# EAGLE schematic aleph (EAGLE 6.4), part 1 of 2

## Sheet 1 of 9
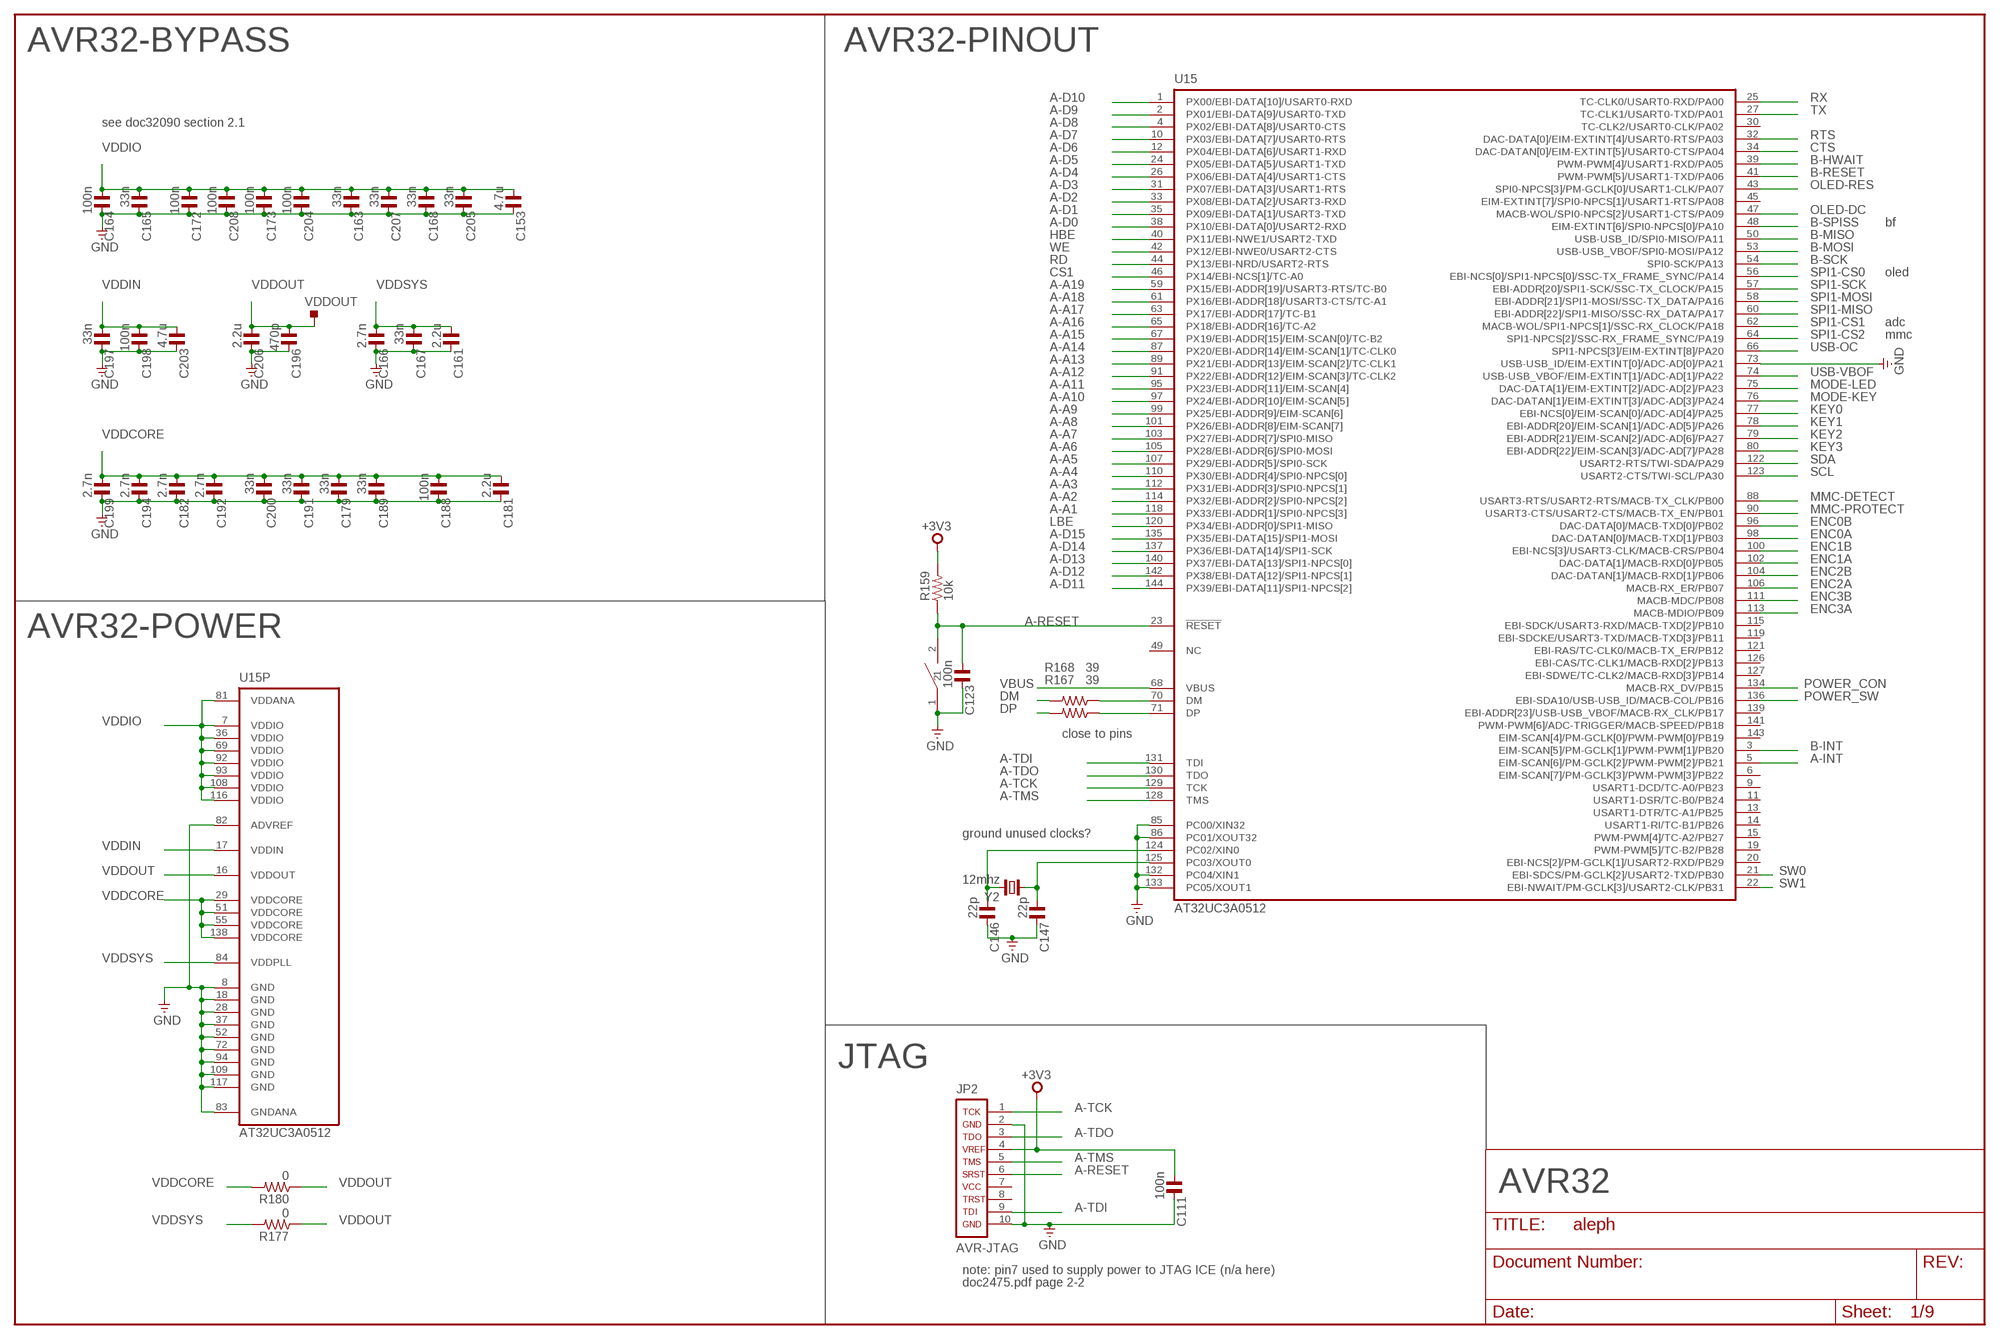
[diagram p0: schematic, sheet 1]

### Parts
C111  100n  C_0603  [C0603]
C123  100n  C_0603  [C0603]
C146  22p  C_0603  [C0603]
C147  22p  C_0603  [C0603]
C153  4.7u  C_1206  [C1206]
C161  2.2u  C_1206  [C1206]
C163  33n  C_0603  [C0603]
C164  100n  C_0603  [C0603]
C165  33n  C_0603  [C0603]
C166  2.7n  C_0603  [C0603]
C167  33n  C_0603  [C0603]
C168  33n  C_0603  [C0603]
C172  100n  C_0603  [C0603]
C173  100n  C_0603  [C0603]
C179  33n  C_0603  [C0603]
C181  2.2u  C_1206  [C1206]
C182  2.7n  C_0603  [C0603]
C188  100n  C_0603  [C0603]
C189  33n  C_0603  [C0603]
C191  33n  C_0603  [C0603]
C192  2.7n  C_0603  [C0603]
C194  2.7n  C_0603  [C0603]
C196  470p  C_0603  [C0603]
C197  33n  C_0603  [C0603]
C198  100n  C_0603  [C0603]
C199  2.7n  C_0603  [C0603]
C200  33n  C_0603  [C0603]
C203  4.7u  C_1206  [C1206]
C204  100n  C_0603  [C0603]
C205  33n  C_0603  [C0603]
C206  2.2u  C_1206  [C1206]
C207  33n  C_0603  [C0603]
C208  100n  C_0603  [C0603]
JP2  AVR-JTAG  AVR-JTAG-10  [AVR-JTAG-10]
R159  10k  R_0603  [R0603]
R167  39  R_0603  [R0603]
R168  39  R_0603  [R0603]
R177  0  R_0603  [R0603]
R180  0  R_0603  [R0603]
SW1  PANASONIC-EVQ  [PANASONIC-EVQ]
U15  AT32UC3A0512  AT32UC3A0128/0256/0512  [LQFP144]
VDDOUT  TPS-SMD-10R  [SMD-10R]
Y2  12mhz  CRYTALHC49UP  [HC49UP]

### Nets
+3V3: C111.1 JP2.4 R159.2 ; also sheet 2,3
A-A1: U15.118(PX33/EBI-ADDR[1]/SPI0-NPCS[3]) ; also sheet 2
A-A2: U15.114(PX32/EBI-ADDR[2]/SPI0-NPCS[2]) ; also sheet 2
A-A3: U15.112(PX31/EBI-ADDR[3]/SPI0-NPCS[1]) ; also sheet 2
A-A4: U15.110(PX30/EBI-ADDR[4]/SPI0-NPCS[0]) ; also sheet 2
A-A5: U15.107(PX29/EBI-ADDR[5]/SPI0-SCK) ; also sheet 2
A-A6: U15.105(PX28/EBI-ADDR[6]/SPI0-MOSI) ; also sheet 2
A-A7: U15.103(PX27/EBI-ADDR[7]/SPI0-MISO) ; also sheet 2
A-A8: U15.101(PX26/EBI-ADDR[8]/EIM-SCAN[7]) ; also sheet 2
A-A9: U15.99(PX25/EBI-ADDR[9]/EIM-SCAN[6]) ; also sheet 2
A-A10: U15.97(PX24/EBI-ADDR[10]/EIM-SCAN[5]) ; also sheet 2
A-A11: U15.95(PX23/EBI-ADDR[11]/EIM-SCAN[4]) ; also sheet 2
A-A12: U15.91(PX22/EBI-ADDR[12]/EIM-SCAN[3]/TC-CLK2) ; also sheet 2
A-A13: U15.89(PX21/EBI-ADDR[13]/EIM-SCAN[2]/TC-CLK1) ; also sheet 2
A-A14: U15.87(PX20/EBI-ADDR[14]/EIM-SCAN[1]/TC-CLK0) ; also sheet 2
A-A15: U15.67(PX19/EBI-ADDR[15]/EIM-SCAN[0]/TC-B2) ; also sheet 2
A-A16: U15.65(PX18/EBI-ADDR[16]/TC-A2) ; also sheet 2
A-A17: U15.63(PX17/EBI-ADDR[17]/TC-B1) ; also sheet 2
A-A18: U15.61(PX16/EBI-ADDR[18]/USART3-CTS/TC-A1) ; also sheet 2
A-A19: U15.59(PX15/EBI-ADDR[19]/USART3-RTS/TC-B0) ; also sheet 2
A-D0: U15.38(PX10/EBI-DATA[0]/USART2-RXD) ; also sheet 2
A-D1: U15.35(PX09/EBI-DATA[1]/USART3-TXD) ; also sheet 2
A-D2: U15.33(PX08/EBI-DATA[2]/USART3-RXD) ; also sheet 2
A-D3: U15.31(PX07/EBI-DATA[3]/USART1-RTS) ; also sheet 2
A-D4: U15.26(PX06/EBI-DATA[4]/USART1-CTS) ; also sheet 2
A-D5: U15.24(PX05/EBI-DATA[5]/USART1-TXD) ; also sheet 2
A-D6: U15.12(PX04/EBI-DATA[6]/USART1-RXD) ; also sheet 2
A-D7: U15.10(PX03/EBI-DATA[7]/USART0-RTS) ; also sheet 2
A-D8: U15.4(PX02/EBI-DATA[8]/USART0-CTS) ; also sheet 2
A-D9: U15.2(PX01/EBI-DATA[9]/USART0-TXD) ; also sheet 2
A-D10: U15.1(PX00/EBI-DATA[10]/USART0-RXD) ; also sheet 2
A-D11: U15.144(PX39/EBI-DATA[11]/SPI1-NPCS[2]) ; also sheet 2
A-D12: U15.142(PX38/EBI-DATA[12]/SPI1-NPCS[1]) ; also sheet 2
A-D13: U15.140(PX37/EBI-DATA[13]/SPI1-NPCS[0]) ; also sheet 2
A-D14: U15.137(PX36/EBI-DATA[14]/SPI1-SCK) ; also sheet 2
A-D15: U15.135(PX35/EBI-DATA[15]/SPI1-MOSI) ; also sheet 2
A-INT: U15.5(EIM-SCAN[6]/PM-GCLK[2]/PWM-PWM[2]/PB21) ; also sheet 4
A-RESET: C123.1 JP2.6 R159.1 SW1.2 U15.23(!RESET)
A-TCK: JP2.1 U15.129(TCK)
A-TDI: JP2.9 U15.131(TDI)
A-TDO: JP2.3 U15.130(TDO)
A-TMS: JP2.5 U15.128(TMS)
B-HWAIT: U15.39(PWM-PWM[4]/USART1-RXD/PA05) ; also sheet 4
B-INT: U15.3(EIM-SCAN[5]/PM-GCLK[1]/PWM-PWM[1]/PB20) ; also sheet 4
B-MISO: U15.50(USB-USB_ID/SPI0-MISO/PA11) ; also sheet 4
B-MOSI: U15.53(USB-USB_VBOF/SPI0-MOSI/PA12) ; also sheet 4
B-RESET: U15.41(PWM-PWM[5]/USART1-TXD/PA06) ; also sheet 4
B-SCK: U15.54(SPI0-SCK/PA13) ; also sheet 4
B-SPISS: U15.48(EIM-EXTINT[6]/SPI0-NPCS[0]/PA10) ; also sheet 4
CS1: U15.46(PX14/EBI-NCS[1]/TC-A0) ; also sheet 2
CTS: U15.34(DAC-DATAN[0]/EIM-EXTINT[5]/USART0-CTS/PA04) ; also sheet 2
DM: R168.2 ; also sheet 2
DP: R167.2 ; also sheet 2
ENC0A: U15.98(DAC-DATAN[0]/MACB-TXD[1]/PB03) ; also sheet 3
ENC0B: U15.96(DAC-DATA[0]/MACB-TXD[0]/PB02) ; also sheet 3
ENC1A: U15.102(DAC-DATA[1]/MACB-RXD[0]/PB05) ; also sheet 3
ENC1B: U15.100(EBI-NCS[3]/USART3-CLK/MACB-CRS/PB04) ; also sheet 3
ENC2A: U15.106(MACB-RX_ER/PB07) ; also sheet 3
ENC2B: U15.104(DAC-DATAN[1]/MACB-RXD[1]/PB06) ; also sheet 3
ENC3A: U15.113(MACB-MDIO/PB09) ; also sheet 3
ENC3B: U15.111(MACB-MDC/PB08) ; also sheet 3
GND: C111.2 C123.2 C146.2 C147.2 C153.2 C161.2 C163.2 C164.2 C165.2 C166.2 C167.2 C168.2 C172.2 C173.2 C179.2 C181.2 C182.2 C188.2 C189.2 C191.2 C192.2 C194.2 C196.2 C197.2 C198.2 C199.2 C200.2 C203.2 C204.2 C205.2 C206.2 C207.2 C208.2 JP2.2 JP2.10 SW1.1 U15.8(GND) U15.18(GND) U15.28(GND) U15.37(GND) U15.52(GND) U15.72(GND) U15.73(USB-USB_ID/EIM-EXTINT[0]/ADC-AD[0]/PA21) U15.82(ADVREF) U15.83(GNDANA) U15.85(PC00/XIN32) U15.86(PC01/XOUT32) U15.94(GND) U15.109(GND) U15.117(GND) U15.132(PC04/XIN1) U15.133(PC05/XOUT1) ; also sheet 2,3,4,5
HBE: U15.40(PX11/EBI-NWE1/USART2-TXD) ; also sheet 2
KEY0: U15.77(EBI-NCS[0]/EIM-SCAN[0]/ADC-AD[4]/PA25) ; also sheet 3
KEY1: U15.78(EBI-ADDR[20]/EIM-SCAN[1]/ADC-AD[5]/PA26) ; also sheet 3
KEY2: U15.79(EBI-ADDR[21]/EIM-SCAN[2]/ADC-AD[6]/PA27) ; also sheet 3
KEY3: U15.80(EBI-ADDR[22]/EIM-SCAN[3]/ADC-AD[7]/PA28) ; also sheet 3
LBE: U15.120(PX34/EBI-ADDR[0]/SPI1-MISO) ; also sheet 2
MMC-DETECT: U15.88(USART3-RTS/USART2-RTS/MACB-TX_CLK/PB00) ; also sheet 2
MMC-PROTECT: U15.90(USART3-CTS/USART2-CTS/MACB-TX_EN/PB01) ; also sheet 2
MODE-KEY: U15.76(DAC-DATAN[1]/EIM-EXTINT[3]/ADC-AD[3]/PA24) ; also sheet 3
MODE-LED: U15.75(DAC-DATA[1]/EIM-EXTINT[2]/ADC-AD[2]/PA23) ; also sheet 3
N$4: C146.1 U15.124(PC02/XIN0) Y2.2
N$5: C147.1 U15.125(PC03/XOUT0) Y2.1
N$44: R168.1 U15.70(DM)
N$45: R167.1 U15.71(DP)
OLED-DC: U15.47(MACB-WOL/SPI0-NPCS[2]/USART1-CTS/PA09) ; also sheet 3
OLED-RES: U15.43(SPI0-NPCS[3]/PM-GCLK[0]/USART1-CLK/PA07) ; also sheet 3
POWER_CON: U15.134(MACB-RX_DV/PB15) ; also sheet 2
POWER_SW: U15.136(EBI-SDA10/USB-USB_ID/MACB-COL/PB16) ; also sheet 2
RD: U15.44(PX13/EBI-NRD/USART2-RTS) ; also sheet 2
RTS: U15.32(DAC-DATA[0]/EIM-EXTINT[4]/USART0-RTS/PA03) ; also sheet 2
RX: U15.25(TC-CLK0/USART0-RXD/PA00) ; also sheet 2
SCL: U15.123(USART2-CTS/TWI-SCL/PA30) ; also sheet 3
SDA: U15.122(USART2-RTS/TWI-SDA/PA29) ; also sheet 3
SPI1-CS0: U15.56(EBI-NCS[0]/SPI1-NPCS[0]/SSC-TX_FRAME_SYNC/PA14) ; also sheet 3
SPI1-CS1: U15.62(MACB-WOL/SPI1-NPCS[1]/SSC-RX_CLOCK/PA18) ; also sheet 3
SPI1-CS2: U15.64(SPI1-NPCS[2]/SSC-RX_FRAME_SYNC/PA19) ; also sheet 2
SPI1-MISO: U15.60(EBI-ADDR[22]/SPI1-MISO/SSC-RX_DATA/PA17) ; also sheet 2,3
SPI1-MOSI: U15.58(EBI-ADDR[21]/SPI1-MOSI/SSC-TX_DATA/PA16) ; also sheet 2,3
SPI1-SCK: U15.57(EBI-ADDR[20]/SPI1-SCK/SSC-TX_CLOCK/PA15) ; also sheet 2,3
SW0: U15.21(EBI-SDCS/PM-GCLK[2]/USART2-TXD/PB30) ; also sheet 3
SW1: U15.22(EBI-NWAIT/PM-GCLK[3]/USART2-CLK/PB31) ; also sheet 3
TX: U15.27(TC-CLK1/USART0-TXD/PA01) ; also sheet 2
USB-OC: U15.66(SPI1-NPCS[3]/EIM-EXTINT[8]/PA20) ; also sheet 2
USB-VBOF: U15.74(USB-USB_VBOF/EIM-EXTINT[1]/ADC-AD[1]/PA22) ; also sheet 2
VBUS: U15.68(VBUS) ; also sheet 2
VDDCORE: C179.1 C181.1 C182.1 C188.1 C189.1 C191.1 C192.1 C194.1 C199.1 C200.1 R180.2 U15.29(VDDCORE) U15.51(VDDCORE) U15.55(VDDCORE) U15.138(VDDCORE)
VDDIN: C197.1 C198.1 C203.1 U15.17(VDDIN) ; also sheet 2
VDDIO: C153.1 C163.1 C164.1 C165.1 C168.1 C172.1 C173.1 C204.1 C205.1 C207.1 C208.1 U15.7(VDDIO) U15.36(VDDIO) U15.69(VDDIO) U15.81(VDDANA) U15.92(VDDIO) U15.93(VDDIO) U15.108(VDDIO) U15.116(VDDIO) ; also sheet 2
VDDOUT: C196.1 C206.1 R177.1 R180.1 U15.16(VDDOUT) VDDOUT.TP
VDDSYS: C161.1 C166.1 C167.1 R177.2 U15.84(VDDPLL)
WE: U15.42(PX12/EBI-NWE0/USART2-CTS) ; also sheet 2
Unconnected: JP2.7 JP2.8 U15.6(EIM-SCAN[7]/PM-GCLK[3]/PWM-PWM[3]/PB22) U15.9(USART1-DCD/TC-A0/PB23) U15.11(USART1-DSR/TC-B0/PB24) U15.13(USART1-DTR/TC-A1/PB25) U15.14(USART1-RI/TC-B1/PB26) U15.15(PWM-PWM[4]/TC-A2/PB27) U15.19(PWM-PWM[5]/TC-B2/PB28) U15.20(EBI-NCS[2]/PM-GCLK[1]/USART2-RXD/PB29) U15.30(TC-CLK2/USART0-CLK/PA02) U15.45(EIM-EXTINT[7]/SPI0-NPCS[1]/USART1-RTS/PA08) U15.49(NC) U15.115(EBI-SDCK/USART3-RXD/MACB-TXD[2]/PB10) U15.119(EBI-SDCKE/USART3-TXD/MACB-TXD[3]/PB11) U15.121(EBI-RAS/TC-CLK0/MACB-TX_ER/PB12) U15.126(EBI-CAS/TC-CLK1/MACB-RXD[2]/PB13) U15.127(EBI-SDWE/TC-CLK2/MACB-RXD[3]/PB14) U15.139(EBI-ADDR[23]/USB-USB_VBOF/MACB-RX_CLK/PB17) U15.141(PWM-PWM[6]/ADC-TRIGGER/MACB-SPEED/PB18) U15.143(EIM-SCAN[4]/PM-GCLK[0]/PWM-PWM[0]/PB19)

### Notes on the sheet
- AVR32-BYPASS | AVR32-PINOUT
- see doc32090 section 2.1
- bf
- oled
- adc
- mmc
- AVR32-POWER
- close to pins
- ground unused clocks?
- JTAG
- AVR32
- note: pin7 used to supply power to JTAG ICE (n/a here)
- doc2475.pdf page 2-2

## Sheet 2 of 9
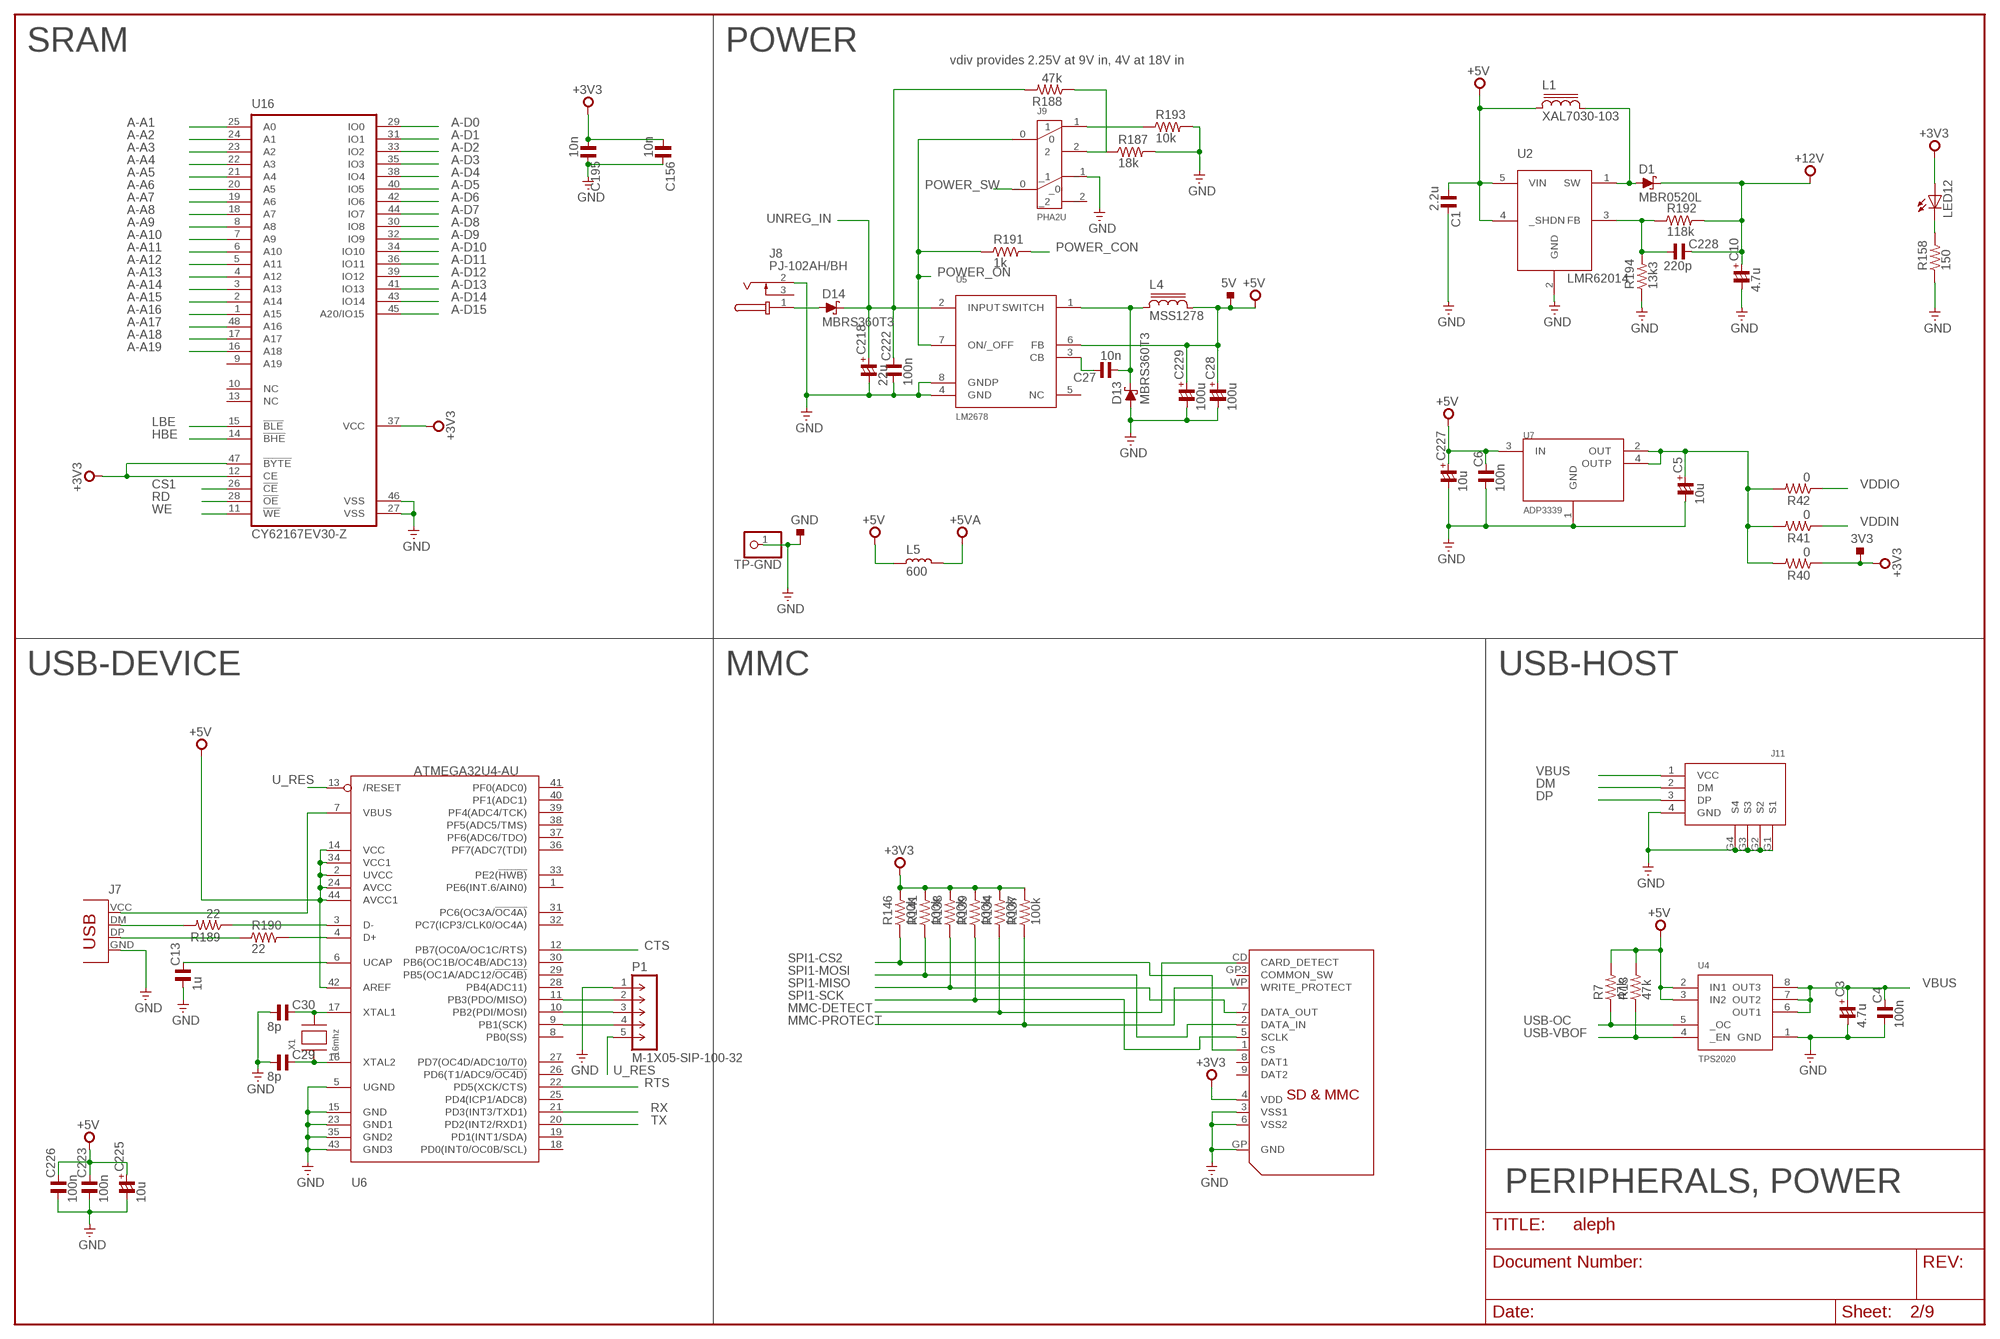
[diagram p1: schematic, sheet 2]

### Parts
3V3  TPS-SMD-15R  [SMD-15R]
5V  TPS-SMD-15R  [SMD-15R]
C1  2.2u  C_1206  [C1206]
C3  4.7u  CP_1206/T  [C1206/T]
C4  100n  C_0603  [C0603]
C5  10u  CP_1206/T  [C1206/T]
C6  100n  C_1206  [C1206]
C10  4.7u  CP_1206/T  [C1206/T]
C13  1u  C_0603  [C0603]
C27  10n  C_0603  [C0603]
C28  100u  CP_7343-43  [C7343-43]
C29  8p  C_0603  [C0603]
C30  8p  C_0603  [C0603]
C156  10n  C_0603  [C0603]
C195  10n  C_0603  [C0603]
C218  22u  CP_6032-28  [C6032-28/T]
C222  100n  C_1206  [C1206]
C223  100n  C_0603  [C0603]
C225  10u  CP_1206/T  [C1206/T]
C226  100n  C_0603  [C0603]
C227  10u  CP_1206/T  [C1206/T]
C228  220p  C_0603  [C0603]
C229  100u  CP_7343-43  [C7343-43]
D1  MBR0520L  MBR0540  [SOD123]
D13  MBRS360T3  [SMC]
D14  MBRS360T3  [SMC]
GND  TPS-SMD-20R  [SMD-20R]
J7  USB_TYPE_B  [USB_B]
J8  PJ-102AH/BH  [PJ-102XH]
J9  PHA2U  [PHA2U]
J11  USBA-VERT  [USBA-VERT]
L1  XAL7030-103  [XAL7030-103]
L4  MSS1278  [MSS1278]
L5  600  L_0603  [L0603]
LED12  LEDCHIPLED_0805  [CHIPLED_0805]
P1  M-1X05-SIP-100-32  [SIP-100-05-32]
R7  47k  R_0603  [R0603]
R13  47k  R_0603  [R0603]
R40  0  R_0603  [R0603]
R41  0  R_0603  [R0603]
R42  0  R_0603  [R0603]
R134  100k  R_0603  [R0603]
R137  100k  R_0603  [R0603]
R138  100k  R_0603  [R0603]
R139  100k  R_0603  [R0603]
R141  100k  R_0603  [R0603]
R146  100k  R_0603  [R0603]
R158  150  R_0603  [R0603]
R187  18k  R_0603  [R0603]
R188  47k  R_0603  [R0603]
R189  22  R_0603  [R0603]
R190  22  R_0603  [R0603]
R191  1k  R_0603  [R0603]
R192  118k  R_0603  [R0603]
R193  10k  R_0603  [R0603]
R194  13k3  R_0603  [R0603]
S1  SDMMC06132  [06132]
TP-GND  PINHD-1X1  [1X01]
U2  LMR62014  [SOT23-5]
U4  TPS2020  [SO08]
U5  LM2678  [TO263-7]
U6  ATMEGA32U4-AU  [TQFP44]
U7  ADP3339  [SOT223]
U16  CY62167EV30-Z  [TSOP48]
X1  16mhz  XTALNX5032  [NX5032]

### Nets
+3V3: 3V3.TP C156.1 C195.1 LED12.A R40.1 R134.2 R137.2 R138.2 R139.2 R141.2 R146.2 S1.4(VDD) U16.12(CE) U16.37(VCC) U16.47(!BYTE!) ; also sheet 1,3
+5V: 5V.TP C1.1 C6.2 C28.+ C223.2 C225.+ C226.2 C227.+ C229.+ L1.P$1 L4.2 L5.2 R7.2 R13.2 U2.4(_SHDN) U2.5(VIN) U4.2(IN1) U4.3(IN2) U5.6(FB) U6.2(UVCC) U6.14(VCC) U6.24(AVCC) U6.34(VCC1) U6.42(AREF) U6.44(AVCC1) U7.3(IN) ; also sheet 3,4,6
+5VA: L5.1 ; also sheet 3,6,7,9
+12V: C10.+ C228.2 D1.C R192.2 ; also sheet 3,6
A-A1: U16.25(A0) ; also sheet 1
A-A2: U16.24(A1) ; also sheet 1
A-A3: U16.23(A2) ; also sheet 1
A-A4: U16.22(A3) ; also sheet 1
A-A5: U16.21(A4) ; also sheet 1
A-A6: U16.20(A5) ; also sheet 1
A-A7: U16.19(A6) ; also sheet 1
A-A8: U16.18(A7) ; also sheet 1
A-A9: U16.8(A8) ; also sheet 1
A-A10: U16.7(A9) ; also sheet 1
A-A11: U16.6(A10) ; also sheet 1
A-A12: U16.5(A11) ; also sheet 1
A-A13: U16.4(A12) ; also sheet 1
A-A14: U16.3(A13) ; also sheet 1
A-A15: U16.2(A14) ; also sheet 1
A-A16: U16.1(A15) ; also sheet 1
A-A17: U16.48(A16) ; also sheet 1
A-A18: U16.17(A17) ; also sheet 1
A-A19: U16.16(A18) ; also sheet 1
A-D0: U16.29(IO0) ; also sheet 1
A-D1: U16.31(IO1) ; also sheet 1
A-D2: U16.33(IO2) ; also sheet 1
A-D3: U16.35(IO3) ; also sheet 1
A-D4: U16.38(IO4) ; also sheet 1
A-D5: U16.40(IO5) ; also sheet 1
A-D6: U16.42(IO6) ; also sheet 1
A-D7: U16.44(IO7) ; also sheet 1
A-D8: U16.30(IO8) ; also sheet 1
A-D9: U16.32(IO9) ; also sheet 1
A-D10: U16.34(IO10) ; also sheet 1
A-D11: U16.36(IO11) ; also sheet 1
A-D12: U16.39(IO12) ; also sheet 1
A-D13: U16.41(IO13) ; also sheet 1
A-D14: U16.43(IO14) ; also sheet 1
A-D15: U16.45(A20/IO15) ; also sheet 1
CS1: U16.26(!CE!) ; also sheet 1
CTS: U6.12(PB7(OC0A/OC1C/RTS)) ; also sheet 1
DM: J11.2(DM) ; also sheet 1
DP: J11.3(DP) ; also sheet 1
GND: C1.2 C3.- C4.1 C5.- C6.1 C10.- C13.1 C28.- C29.1 C30.1 C156.2 C195.2 C218.- C222.1 C223.1 C225.- C226.1 C227.- C229.- D13.A GND.TP J7.GND J8.2(S) J9._1 J11.4(GND) J11.G1(S1) J11.G2(S2) J11.G3(S3) J11.G4(S4) P1.1 R158.1 R187.2 R193.2 R194.1 S1.3(VSS1) S1.6(VSS2) S1.GP(GND) TP-GND.1 U2.2(GND) U4.1(GND) U5.4(GND) U5.8(GNDP) U6.5(UGND) U6.15(GND) U6.23(GND1) U6.35(GND2) U6.43(GND3) U7.1(GND) U16.27(VSS) U16.46(VSS) ; also sheet 1,3,4,5
HBE: U16.14(!BHE!) ; also sheet 1
LBE: U16.15(!BLE!) ; also sheet 1
MMC-DETECT: R134.1 S1.CD(CARD_DETECT) ; also sheet 1
MMC-PROTECT: R137.1 S1.WP(WRITE_PROTECT) ; also sheet 1
N$3: D14.A J8.1(T)
N$6: J7.DM(USBDM) R189.2
N$7: C27.1 D13.C L4.1 U5.1(SWITCH)
N$9: C27.2 U5.3(CB)
N$12: J7.DP(USBDP) R190.1
N$13: R190.2 U6.4(D+)
N$15: LED12.C R158.2
N$17: R189.1 U6.3(D-)
N$32: C5.+ R40.2 R41.2 R42.2 U7.2(OUT) U7.4(OUTP)
N$50: J9.1 R193.1
N$55: J9.2 R187.1 R188.1
N$109: C29.2 U6.16(XTAL2) X1.P$1
N$112: C30.2 U6.17(XTAL1) X1.P$2
N$133: D1.A L1.P$2 U2.1(SW)
N$134: C228.1 R192.1 R194.2 U2.3(FB)
N$160: C13.2 U6.6(UCAP)
N$161: J7.VCC U6.7(VBUS)
POWER_CON: R191.2 ; also sheet 1
POWER_ON: J9.0 R191.1 U5.7(ON/_OFF)
POWER_SW: J9._0 ; also sheet 1
RD: U16.28(!OE!) ; also sheet 1
RTS: U6.22(PD5(XCK/CTS)) ; also sheet 1
RX: U6.21(PD3(INT3/TXD1)) ; also sheet 1
SPI1-CS2: R146.1 S1.1(CS) ; also sheet 1
SPI1-MISO: R138.1 S1.7(DATA_OUT) ; also sheet 1,3
SPI1-MOSI: R141.1 S1.2(DATA_IN) ; also sheet 1,3
SPI1-SCK: R139.1 S1.5(SCLK) ; also sheet 1,3
TX: U6.20(PD2(INT2/RXD1)) ; also sheet 1
U-MISO: P1.2 U6.11(PB3(PDO/MISO))
U-MOSI: P1.3 U6.10(PB2(PDI/MOSI))
U-SCK: P1.4 U6.9(PB1(SCK))
U_RES: P1.5 U6.13(/RESET)
UNREG_IN: C218.+ C222.2 D14.C R188.2 U5.2(INPUT)
USB-OC: R7.1 U4.5(_OC) ; also sheet 1
USB-VBOF: R13.1 U4.4(_EN) ; also sheet 1
VBUS: C3.+ C4.2 J11.1(VCC) U4.6(OUT1) U4.7(OUT2) U4.8(OUT3) ; also sheet 1
VDDIN: R41.1 ; also sheet 1
VDDIO: R42.1 ; also sheet 1
WE: U16.11(!WE!) ; also sheet 1
Unconnected: J8.3(SS) J9._2 S1.8(DAT1) S1.9(DAT2) S1.GP3(COMMON_SW) U5.5(NC) U6.1(PE6(INT.6/AIN0)) U6.8(PB0(SS)) U6.18(PD0(INT0/OC0B/SCL)) U6.19(PD1(INT1/SDA)) U6.25(PD4(ICP1/ADC8)) U6.26(PD6(T1/ADC9/!OC4D)) U6.27(PD7(OC4D/ADC10/T0)) U6.28(PB4(ADC11)) U6.29(PB5(OC1A/ADC12/!OC4B)) U6.30(PB6(OC1B/OC4B/ADC13)) U6.31(PC6(OC3A/!OC4A)) U6.32(PC7(ICP3/CLK0/OC4A)) U6.33(PE2(!HWB)) U6.36(PF7(ADC7(TDI)) U6.37(PF6(ADC6/TDO)) U6.38(PF5(ADC5/TMS)) U6.39(PF4(ADC4/TCK)) U6.40(PF1(ADC1)) U6.41(PF0(ADC0)) U16.9(A19) U16.10(NC) U16.13(NC)

### Notes on the sheet
- SRAM | POWER
- vdiv provides 2.25V at 9V in, 4V at 18V in
- USB-DEVICE | MMC | USB-HOST
- PERIPHERALS, POWER

## Sheet 3 of 9
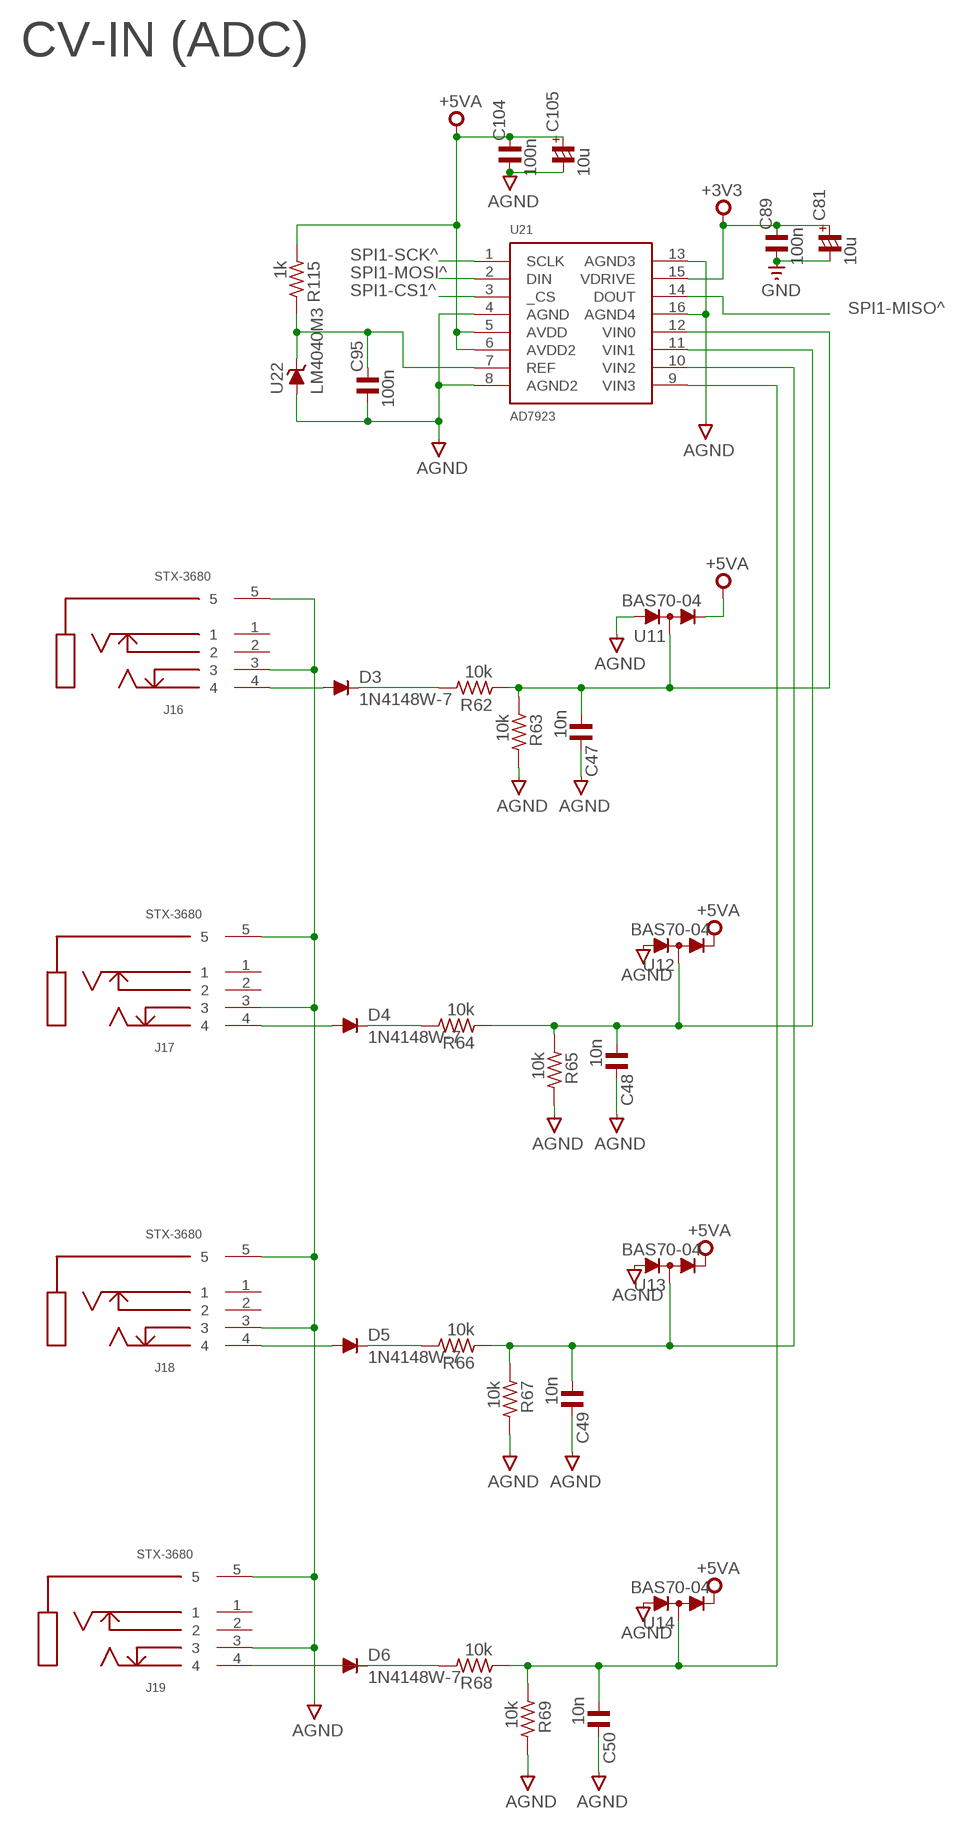
[diagram p2: schematic, sheet 3, part 1 of 2]
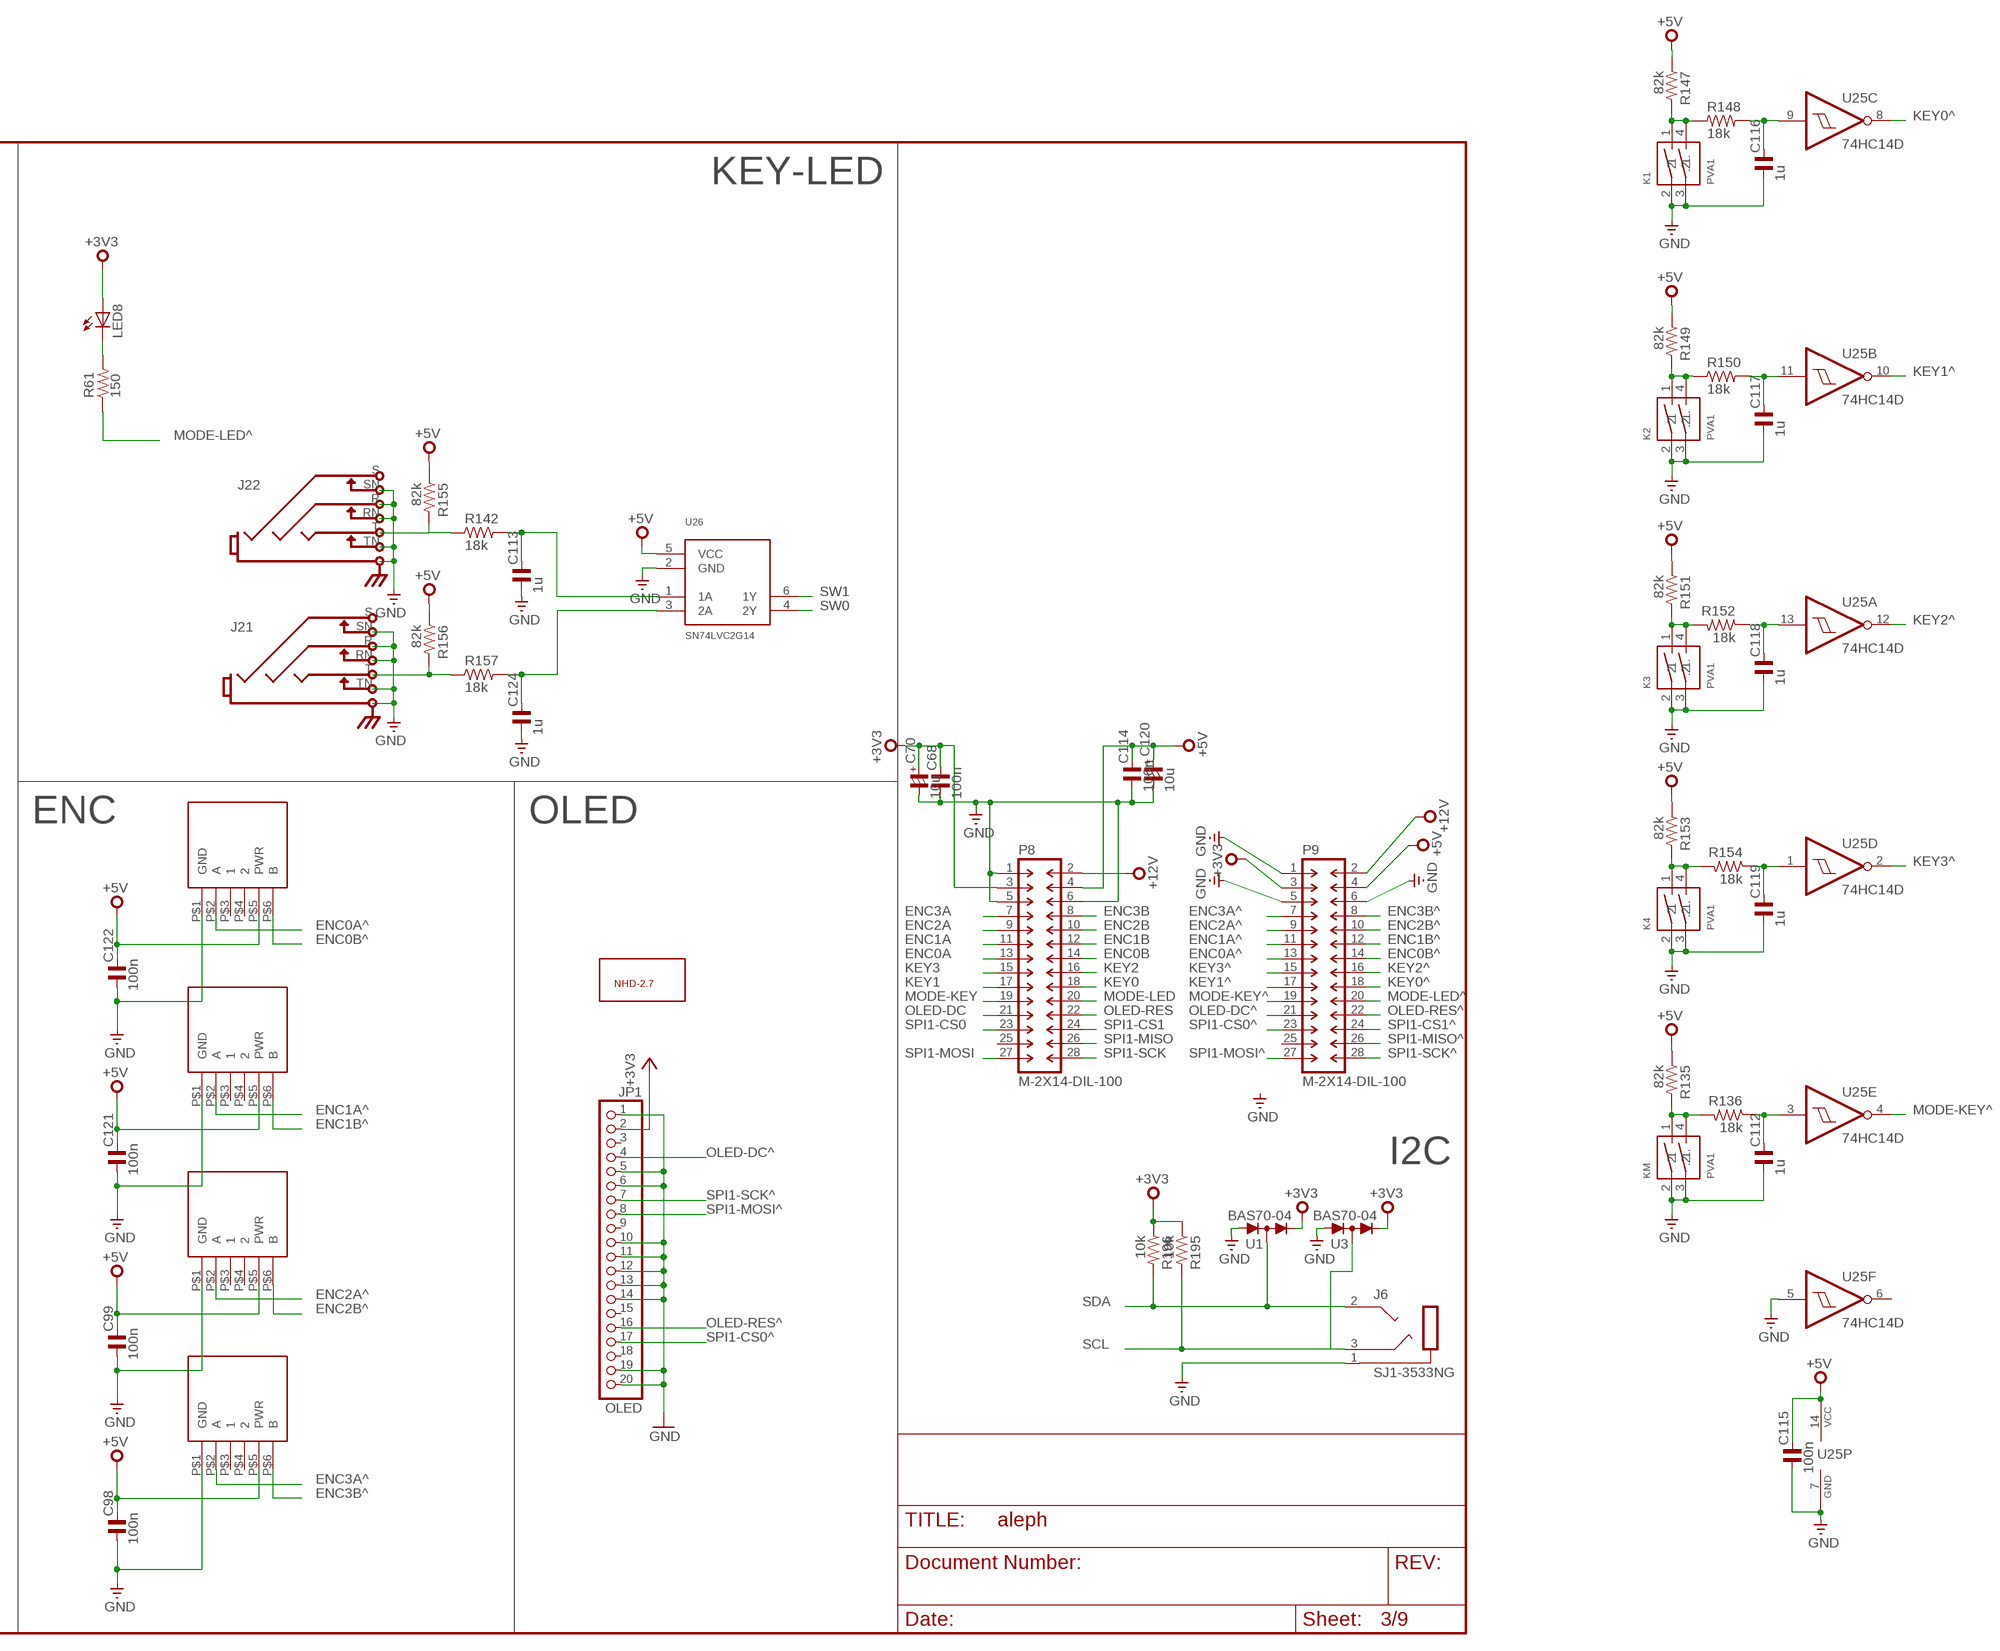
[diagram p3: schematic, sheet 3, part 2 of 2]

### Parts
C47  10n  C_0603  [C0603]
C48  10n  C_0603  [C0603]
C49  10n  C_0603  [C0603]
C50  10n  C_0603  [C0603]
C68  100n  C_0603  [C0603]
C70  10u  CP_1206/T  [C1206/T]
C81  10u  CP_1206/T  [C1206/T]
C89  100n  C_0603  [C0603]
C95  100n  C_0603  [C0603]
C98  100n  C_0603  [C0603]
C99  100n  C_0603  [C0603]
C104  100n  C_0603  [C0603]
C105  10u  CP_1206/T  [C1206/T]
C112  1u  C_0603  [C0603]
C113  1u  C_0603  [C0603]
C114  100n  C_0603  [C0603]
C115  100n  C_0603  [C0603]
C116  1u  C_0603  [C0603]
C117  1u  C_0603  [C0603]
C118  1u  C_0603  [C0603]
C119  1u  C_0603  [C0603]
C120  10u  CP_1206/T  [C1206/T]
C121  100n  C_0603  [C0603]
C122  100n  C_0603  [C0603]
C124  1u  C_0603  [C0603]
D3  1N4148W-7  [SOD123]
D4  1N4148W-7  [SOD123]
D5  1N4148W-7  [SOD123]
D6  1N4148W-7  [SOD123]
E1  BOURNS-EM14  [BOURNS-EM14]
E2  BOURNS-EM14  [BOURNS-EM14]
E3  BOURNS-EM14  [BOURNS-EM14]
E4  BOURNS-EM14  [BOURNS-EM14]
J6  SJ1-3533NG  [SJ1-3533NG]
J16  STX-3680  [STX-3680]
J17  STX-3680  [STX-3680]
J18  STX-3680  [STX-3680]
J19  STX-3680  [STX-3680]
J21  STEREOSW3GND  [NEUTRIK-NRJ6HF-1]
J22  STEREOSW3GND  [NEUTRIK-NRJ6HF-1]
JP1  OLED  PINHD-1X20  [1X20]
K1  PVA1  [PVA1]
K2  PVA1  [PVA1]
K3  PVA1  [PVA1]
K4  PVA1  [PVA1]
KM  PVA1  [PVA1]
LED8  LEDCHIPLED_0805  [CHIPLED_0805]
P8  M-2X14-DIL-100  [DIL-100-2X14]
P9  M-2X14-DIL-100  [DIL-100-2X14]
R61  150  R_0603  [R0603]
R62  10k  R_0603  [R0603]
R63  10k  R_0603  [R0603]
R64  10k  R_0603  [R0603]
R65  10k  R_0603  [R0603]
R66  10k  R_0603  [R0603]
R67  10k  R_0603  [R0603]
R68  10k  R_0603  [R0603]
R69  10k  R_0603  [R0603]
R115  1k  R_0603  [R0603]
R135  82k  R_0603  [R0603]
R136  18k  R_0603  [R0603]
R142  18k  R_0603  [R0603]
R147  82k  R_0603  [R0603]
R148  18k  R_0603  [R0603]
R149  82k  R_0603  [R0603]
R150  18k  R_0603  [R0603]
R151  82k  R_0603  [R0603]
R152  18k  R_0603  [R0603]
R153  82k  R_0603  [R0603]
R154  18k  R_0603  [R0603]
R155  82k  R_0603  [R0603]
R156  82k  R_0603  [R0603]
R157  18k  R_0603  [R0603]
R195  10k  R_0603  [R0603]
R196  10k  R_0603  [R0603]
REF-OLED  NHD-2.7  [NHD-2.7]
U1  BAS70-04  [SOT23]
U3  BAS70-04  [SOT23]
U11  BAS70-04  [SOT23]
U12  BAS70-04  [SOT23]
U13  BAS70-04  [SOT23]
U14  BAS70-04  [SOT23]
U21  AD7923  [TSSOP16]
U22  LM4040M3  [SOT23]
U25  74HC14D  [SO14]
U26  SN74LVC2G14  [SOT23-6]

### Nets
+3V3: C68.2 C70.+ C81.+ C89.2 JP1.2 LED8.A P8.3 P9.3 R195.1 R196.1 U1.2(C) U3.2(C) U21.15(VDRIVE) ; also sheet 1,2
+5V: C98.2 C99.2 C114.2 C115.2 C120.+ C121.2 C122.2 E1.P$5(PWR) E2.P$5(PWR) E3.P$5(PWR) E4.P$5(PWR) P8.4 P9.4 R135.1 R147.1 R149.1 R151.1 R153.1 R155.1 R156.1 U25.14(P:VCC) U26.5(VCC) ; also sheet 2,4,6
+5VA: C104.2 C105.+ R115.1 U11.2(C) U12.2(C) U13.2(C) U14.2(C) U21.5(AVDD) U21.6(AVDD2) ; also sheet 2,6,7,9
+12V: P8.2 P9.2 ; also sheet 2,6
AGND: C47.2 C48.2 C49.2 C50.2 C95.1 C104.1 C105.- J16.3 J16.5 J17.3 J17.5 J18.3 J18.5 J19.3 J19.5 R63.2 R65.2 R67.2 R69.2 U11.1(A) U12.1(A) U13.1(A) U14.1(A) U21.4(AGND) U21.8(AGND2) U21.13(AGND3) U21.16(AGND4) U22.2(A) ; also sheet 5,6,7,8,9
ENC0A: P8.13 ; also sheet 1
ENC0A^: E1.P$2(A) P9.13
ENC0B: P8.14 ; also sheet 1
ENC0B^: E1.P$6(B) P9.14
ENC1A: P8.11 ; also sheet 1
ENC1A^: E2.P$2(A) P9.11
ENC1B: P8.12 ; also sheet 1
ENC1B^: E2.P$6(B) P9.12
ENC2A: P8.9 ; also sheet 1
ENC2A^: E4.P$2(A) P9.9
ENC2B: P8.10 ; also sheet 1
ENC2B^: E4.P$6(B) P9.10
ENC3A: P8.7 ; also sheet 1
ENC3A^: E3.P$2(A) P9.7
ENC3B: P8.8 ; also sheet 1
ENC3B^: E3.P$6(B) P9.8
GND: C68.1 C70.- C81.- C89.1 C98.1 C99.1 C112.1 C113.1 C114.1 C115.1 C116.1 C117.1 C118.1 C119.1 C120.- C121.1 C122.1 C124.1 E1.P$1(GND) E2.P$1(GND) E3.P$1(GND) E4.P$1(GND) J6.1(S) J21.R J21.RN J21.SN J21.TN J22.R J22.RN J22.SN J22.TN JP1.1 JP1.5 JP1.6 JP1.10 JP1.11 JP1.12 JP1.13 JP1.14 JP1.19 JP1.20 K1.2 K1.3(1.) K2.2 K2.3(1.) K3.2 K3.3(1.) K4.2 K4.3(1.) KM.2 KM.3(1.) P8.1 P8.5 P8.6 P9.1 P9.5 P9.6 U1.1(A) U3.1(A) U25.5(F:I) U25.7(P:GND) U26.2(GND) ; also sheet 1,2,4,5
KEY0: P8.18 ; also sheet 1
KEY0^: P9.18 U25.8(C:O)
KEY1: P8.17 ; also sheet 1
KEY1^: P9.17 U25.10(B:O)
KEY2: P8.16 ; also sheet 1
KEY2^: P9.16 U25.12(A:O)
KEY3: P8.15 ; also sheet 1
KEY3^: P9.15 U25.2(D:O)
MODE-KEY: P8.19 ; also sheet 1
MODE-KEY^: P9.19 U25.4(E:O)
MODE-LED: P8.20 ; also sheet 1
MODE-LED^: P9.20 R61.1
N$2: K1.1 K1.4(.2) R147.2 R148.1
N$8: C116.2 R148.2 U25.9(C:I)
N$10: K2.1 K2.4(.2) R149.2 R150.1
N$11: C117.2 R150.2 U25.11(B:I)
N$20: LED8.C R61.2
N$21: K3.1 K3.4(.2) R151.2 R152.2
N$23: C118.2 R152.1 U25.13(A:I)
N$27: K4.1 K4.4(.2) R153.2 R154.2
N$30: C119.2 R154.1 U25.1(D:I)
N$34: D3.A J16.4
N$37: D4.C R64.2
N$39: D3.C R62.2
N$40: D5.C R66.2
N$42: D4.A J17.4
N$43: KM.1 KM.4(.2) R135.2 R136.2
N$46: D6.C R68.2
N$48: D5.A J18.4
N$49: C112.2 R136.1 U25.3(E:I)
N$52: D6.A J19.4
N$54: C124.2 R157.2 U26.3(2A)
N$58: C95.2 R115.2 U21.7(REF) U22.1(C)
N$116: C48.1 R64.1 R65.1 U12.3(AC) U21.11(VIN1)
N$117: C49.1 R66.1 R67.1 U13.3(AC) U21.10(VIN2)
N$118: C50.1 R68.1 R69.1 U14.3(AC) U21.9(VIN3)
N$119: C47.1 R62.1 R63.1 U11.3(AC) U21.12(VIN0)
N$124: C113.2 R142.2 U26.1(1A)
OLED-DC: P8.21 ; also sheet 1
OLED-DC^: JP1.4 P9.21
OLED-RES: P8.22 ; also sheet 1
OLED-RES^: JP1.16 P9.22
SCL: J6.3(R) R195.2 U3.3(AC) ; also sheet 1
SDA: J6.2(T) R196.2 U1.3(AC) ; also sheet 1
SPI1-CS0: P8.23 ; also sheet 1
SPI1-CS0^: JP1.17 P9.23
SPI1-CS1: P8.24 ; also sheet 1
SPI1-CS1^: P9.24 U21.3(_CS)
SPI1-MISO: P8.26 ; also sheet 1,2
SPI1-MISO^: P9.26 U21.14(DOUT)
SPI1-MOSI: P8.27 ; also sheet 1,2
SPI1-MOSI^: JP1.8 P9.27 U21.2(DIN)
SPI1-SCK: P8.28 ; also sheet 1,2
SPI1-SCK^: JP1.7 P9.28 U21.1(SCLK)
SW0: U26.4(2Y) ; also sheet 1
SW0CON^: J22.T R142.1 R155.2
SW1: U26.6(1Y) ; also sheet 1
SW1CON^: J21.T R156.2 R157.1
Unconnected: E1.P$3 E1.P$4 E2.P$3 E2.P$4 E3.P$3 E3.P$4 E4.P$3 E4.P$4 J16.1 J16.2 J17.1 J17.2 J18.1 J18.2 J19.1 J19.2 J21.S J22.S JP1.3 JP1.9 JP1.15 JP1.18 P8.25 P9.25 U25.6(F:O)

### Notes on the sheet
- KEY-LED
- CV-IN (ADC)
- ENC | OLED
- I2C

## Sheet 4 of 9
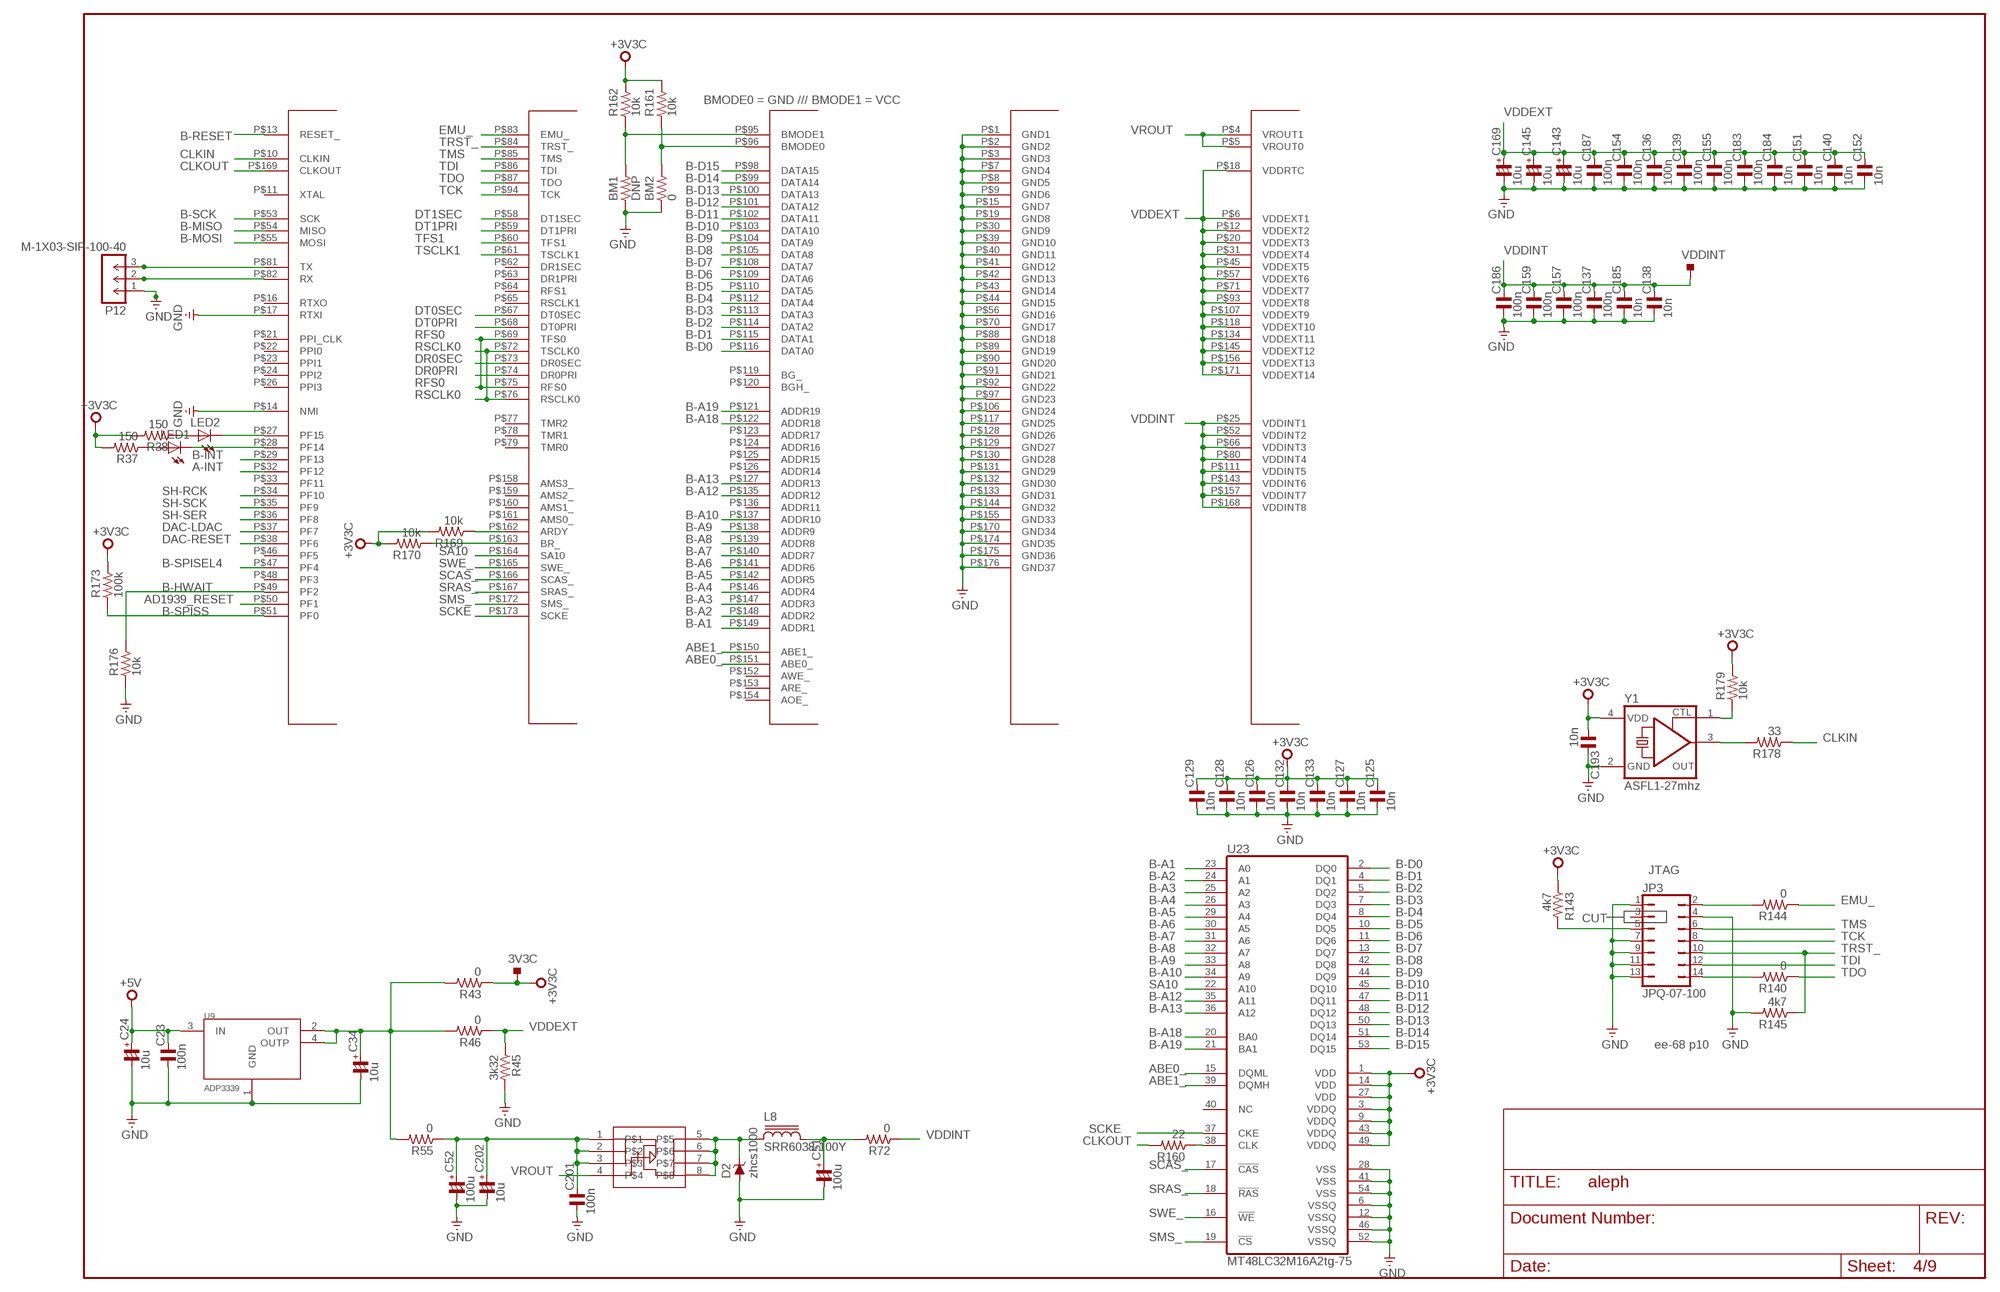
[diagram p4: schematic, sheet 4]

### Parts
3V3C  TPS-SMD-15R  [SMD-15R]
BM1  DNP  R_0603  [R0603]
BM2  0  R_0603  [R0603]
C23  100n  C_1206  [C1206]
C24  10u  CP_1206/T  [C1206/T]
C34  10u  CP_1206/T  [C1206/T]
C51  100u  CP_1210/T  [C1210/T]
C52  100u  CP_1210/T  [C1210/T]
C125  10n  C_0603  [C0603]
C126  10n  C_0603  [C0603]
C127  10n  C_0603  [C0603]
C128  10n  C_0603  [C0603]
C129  10n  C_0603  [C0603]
C132  10n  C_0603  [C0603]
C133  10n  C_0603  [C0603]
C136  100n  C_0603  [C0603]
C137  100n  C_0603  [C0603]
C138  10n  C_0603  [C0603]
C139  100n  C_0603  [C0603]
C140  10n  C_0603  [C0603]
C143  10u  CP_1206/T  [C1206/T]
C145  10u  CP_1206/T  [C1206/T]
C151  10n  C_0603  [C0603]
C152  10n  C_0603  [C0603]
C154  100n  C_0603  [C0603]
C155  100n  C_0603  [C0603]
C157  100n  C_0603  [C0603]
C159  100n  C_0603  [C0603]
C169  10u  CP_1206/T  [C1206/T]
C183  100n  C_0603  [C0603]
C184  10n  C_0603  [C0603]
C185  10n  C_0603  [C0603]
C186  100n  C_0603  [C0603]
C187  100n  C_0603  [C0603]
C193  10n  C_0603  [C0603]
C201  100n  C_1206  [C1206]
C202  10u  CP_1206/T  [C1206/T]
D2  zhcs1000  ZENER-DIODESOT23  [SOT23]
DSP1  BF533  [LQFP176]
JP3  JPQ-07-100  [JPQ-07]
L8  SRR6038-100Y  SRR6038  [SRR6038]
LED1  LEDCHIPLED_0805  [CHIPLED_0805]
LED2  LEDCHIPLED_0805  [CHIPLED_0805]
P12  M-1X03-SIP-100-40  [SIP-100-03-40]
R37  150  R_0603  [R0603]
R38  150  R_0603  [R0603]
R43  0  R_0603  [R0603]
R45  3k32  R_0603  [R0603]
R46  0  R_0603  [R0603]
R55  0  R_0603  [R0603]
R72  0  R_0603  [R0603]
R140  0  R_0603  [R0603]
R143  4k7  R_0603  [R0603]
R144  0  R_0603  [R0603]
R145  4k7  R_0603  [R0603]
R160  22  R_0603  [R0603]
R161  10k  R_0603  [R0603]
R162  10k  R_0603  [R0603]
R169  10k  R_0603  [R0603]
R170  10k  R_0603  [R0603]
R173  100k  R_0603  [R0603]
R176  10k  R_0603  [R0603]
R178  33  R_0603  [R0603]
R179  10k  R_0603  [R0603]
U9  ADP3339  [SOT223]
U10  FDS9431A  [SO08]
U23  MT48LC32M16A2tg-75  MT48LC16M16A2  [TSOP54]
VDDINT  TPS-SMD-10R  [SMD-10R]
Y1  ASFL1-27mhz  ASFL1  [ASFL1]

### Nets
+3V3C: 3V3C.TP C125.2 C126.2 C127.2 C128.2 C129.2 C132.2 C133.2 C193.1 R37.2 R38.2 R43.1 R143.1 R161.2 R162.2 R169.2 R170.2 R173.2 R179.2 U23.1(VDD) U23.3(VDDQ) U23.9(VDDQ) U23.14(VDD) U23.27(VDD) U23.43(VDDQ) U23.49(VDDQ) Y1.4(VDD) ; also sheet 5,6
+5V: C23.2 C24.+ U9.3(IN) ; also sheet 2,3,6
A-INT: DSP1.P$32(PF12) ; also sheet 1
ABE0_: DSP1.P$151(ABE0_) U23.15(DQML)
ABE1_: DSP1.P$150(ABE1_) U23.39(DQMH)
AD1939_RESET: DSP1.P$50(PF1) ; also sheet 5
B-A1: DSP1.P$149(ADDR1) U23.23(A0)
B-A2: DSP1.P$148(ADDR2) U23.24(A1)
B-A3: DSP1.P$147(ADDR3) U23.25(A2)
B-A4: DSP1.P$146(ADDR4) U23.26(A3)
B-A5: DSP1.P$142(ADDR5) U23.29(A4)
B-A6: DSP1.P$141(ADDR6) U23.30(A5)
B-A7: DSP1.P$140(ADDR7) U23.31(A6)
B-A8: DSP1.P$139(ADDR8) U23.32(A7)
B-A9: DSP1.P$138(ADDR9) U23.33(A8)
B-A10: DSP1.P$137(ADDR10) U23.34(A9)
B-A12: DSP1.P$135(ADDR12) U23.35(A11)
B-A13: DSP1.P$127(ADDR13) U23.36(A12)
B-A18: DSP1.P$122(ADDR18) U23.20(BA0)
B-A19: DSP1.P$121(ADDR19) U23.21(BA1)
B-D0: DSP1.P$116(DATA0) U23.2(DQ0)
B-D1: DSP1.P$115(DATA1) U23.4(DQ1)
B-D2: DSP1.P$114(DATA2) U23.5(DQ2)
B-D3: DSP1.P$113(DATA3) U23.7(DQ3)
B-D4: DSP1.P$112(DATA4) U23.8(DQ4)
B-D5: DSP1.P$110(DATA5) U23.10(DQ5)
B-D6: DSP1.P$109(DATA6) U23.11(DQ6)
B-D7: DSP1.P$108(DATA7) U23.13(DQ7)
B-D8: DSP1.P$105(DATA8) U23.42(DQ8)
B-D9: DSP1.P$104(DATA9) U23.44(DQ9)
B-D10: DSP1.P$103(DATA10) U23.45(DQ10)
B-D11: DSP1.P$102(DATA11) U23.47(DQ11)
B-D12: DSP1.P$101(DATA12) U23.48(DQ12)
B-D13: DSP1.P$100(DATA13) U23.50(DQ13)
B-D14: DSP1.P$99(DATA14) U23.51(DQ14)
B-D15: DSP1.P$98(DATA15) U23.53(DQ15)
B-HWAIT: DSP1.P$49(PF2) R176.2 ; also sheet 1
B-INT: DSP1.P$29(PF13) ; also sheet 1
B-MISO: DSP1.P$54(MISO) ; also sheet 1
B-MOSI: DSP1.P$55(MOSI) ; also sheet 1
B-RESET: DSP1.P$13(RESET_) ; also sheet 1
B-SCK: DSP1.P$53(SCK) ; also sheet 1
B-SPISEL4: DSP1.P$47(PF4)
B-SPISS: DSP1.P$51(PF0) R173.1 ; also sheet 1
BMODE0: BM2.2 DSP1.P$96(BMODE0) R161.1
BMODE1: BM1.2 DSP1.P$95(BMODE1) R162.1
CLKIN: DSP1.P$10(CLKIN) R178.1
CLKOUT: DSP1.P$169(CLKOUT) R160.2
DAC-LDAC: DSP1.P$37(PF7) ; also sheet 6
DAC-RESET: DSP1.P$38(PF6) ; also sheet 6
DR0PRI: DSP1.P$74(DR0PRI) ; also sheet 5
DR0SEC: DSP1.P$73(DR0SEC) ; also sheet 5
DT0PRI: DSP1.P$68(DT0PRI) ; also sheet 5
DT0SEC: DSP1.P$67(DT0SEC) ; also sheet 5
DT1PRI: DSP1.P$59(DT1PRI)
DT1SEC: DSP1.P$58(DT1SEC) ; also sheet 6
EMU_: DSP1.P$83(EMU_) R144.1
GND: BM1.1 BM2.1 C23.1 C24.- C34.- C51.- C52.- C125.1 C126.1 C127.1 C128.1 C129.1 C132.1 C133.1 C136.1 C137.1 C138.1 C139.1 C140.1 C143.- C145.- C151.1 C152.1 C154.1 C155.1 C157.1 C159.1 C169.- C183.1 C184.1 C185.1 C186.1 C187.1 C193.2 C201.1 C202.- D2.1(A) DSP1.P$1(GND1) DSP1.P$2(GND2) DSP1.P$3(GND3) DSP1.P$7(GND4) DSP1.P$8(GND5) DSP1.P$9(GND6) DSP1.P$14(NMI) DSP1.P$15(GND7) DSP1.P$17(RTXI) DSP1.P$19(GND8) DSP1.P$30(GND9) DSP1.P$39(GND10) DSP1.P$40(GND11) DSP1.P$41(GND12) DSP1.P$42(GND13) DSP1.P$43(GND14) DSP1.P$44(GND15) DSP1.P$56(GND16) DSP1.P$70(GND17) DSP1.P$88(GND18) DSP1.P$89(GND19) DSP1.P$90(GND20) DSP1.P$91(GND21) DSP1.P$92(GND22) DSP1.P$97(GND23) DSP1.P$106(GND24) DSP1.P$117(GND25) DSP1.P$128(GND26) DSP1.P$129(GND27) DSP1.P$130(GND28) DSP1.P$131(GND29) DSP1.P$132(GND30) DSP1.P$133(GND31) DSP1.P$144(GND32) DSP1.P$155(GND33) DSP1.P$170(GND34) DSP1.P$174(GND35) DSP1.P$175(GND36) DSP1.P$176(GND37) JP3.1 JP3.4 JP3.7 JP3.9 JP3.11 JP3.13 P12.1 R45.2 R145.2 R176.1 U9.1(GND) U23.6(VSSQ) U23.12(VSSQ) U23.28(VSS) U23.41(VSS) U23.46(VSSQ) U23.52(VSSQ) U23.54(VSS) Y1.2(GND) ; also sheet 1,2,3,5
N$16: C34.+ R43.2 R46.2 R55.2 U9.2(OUT) U9.4(OUTP)
N$18: C52.+ C201.2 C202.+ R55.1 U10.1 U10.2 U10.3
N$19: D2.3(C) L8.1 U10.5 U10.6 U10.7 U10.8
N$22: C51.+ L8.2 R72.2
N$24: R160.1 U23.38(CLK)
N$25: R179.1 Y1.1(CTL)
N$26: JP3.2 R144.2
N$28: JP3.5 R143.2
N$29: DSP1.P$163(BR_) R170.1
N$31: JP3.14 R140.2
N$35: DSP1.P$162(ARDY) R169.1
N$38: R178.2 Y1.3(OUT)
N$60: DSP1.P$27(PF15) LED2.C
N$64: DSP1.P$28(PF14) LED1.C
N$66: LED2.A R38.1
N$67: LED1.A R37.1
N$155: DSP1.P$81(TX) P12.3
N$183: DSP1.P$82(RX) P12.2
RFS0: DSP1.P$69(TFS0) DSP1.P$75(RFS0) ; also sheet 5
RSCLK0: DSP1.P$72(TSCLK0) DSP1.P$76(RSCLK0) ; also sheet 5
SA10: DSP1.P$164(SA10) U23.22(A10)
SCAS_: DSP1.P$166(SCAS_) U23.17(!CAS!)
SCKE: DSP1.P$173(SCKE) U23.37(CKE)
SH-RCK: DSP1.P$34(PF10)
SH-SCK: DSP1.P$35(PF9)
SH-SER: DSP1.P$36(PF8)
SMS_: DSP1.P$172(SMS_) U23.19(!CS!)
SRAS_: DSP1.P$167(SRAS_) U23.18(!RAS!)
SWE_: DSP1.P$165(SWE_) U23.16(!WE!)
TCK: DSP1.P$94(TCK) JP3.8
TDI: DSP1.P$86(TDI) JP3.12
TDO: DSP1.P$87(TDO) R140.1
TFS1: DSP1.P$60(TFS1) ; also sheet 6
TMS: DSP1.P$85(TMS) JP3.6
TRST_: DSP1.P$84(TRST_) JP3.10 R145.1
TSCLK1: DSP1.P$61(TSCLK1) ; also sheet 6
VDDEXT: C136.2 C139.2 C140.2 C143.+ C145.+ C151.2 C152.2 C154.2 C155.2 C169.+ C183.2 C184.2 C187.2 DSP1.P$6(VDDEXT1) DSP1.P$12(VDDEXT2) DSP1.P$18(VDDRTC) DSP1.P$20(VDDEXT3) DSP1.P$31(VDDEXT4) DSP1.P$45(VDDEXT5) DSP1.P$57(VDDEXT6) DSP1.P$71(VDDEXT7) DSP1.P$93(VDDEXT8) DSP1.P$107(VDDEXT9) DSP1.P$118(VDDEXT10) DSP1.P$134(VDDEXT11) DSP1.P$145(VDDEXT12) DSP1.P$156(VDDEXT13) DSP1.P$171(VDDEXT14) R45.1 R46.1
VDDINT: C137.2 C138.2 C157.2 C159.2 C185.2 C186.2 DSP1.P$25(VDDINT1) DSP1.P$52(VDDINT2) DSP1.P$66(VDDINT3) DSP1.P$80(VDDINT4) DSP1.P$111(VDDINT5) DSP1.P$143(VDDINT6) DSP1.P$157(VDDINT7) DSP1.P$168(VDDINT8) R72.1 VDDINT.TP
VROUT: DSP1.P$4(VROUT1) DSP1.P$5(VROUT0) U10.4
Unconnected: DSP1.P$11(XTAL) DSP1.P$16(RTXO) DSP1.P$21(PPI_CLK) DSP1.P$22(PPI0) DSP1.P$23(PPI1) DSP1.P$24(PPI2) DSP1.P$26(PPI3) DSP1.P$33(PF11) DSP1.P$46(PF5) DSP1.P$48(PF3) DSP1.P$62(DR1SEC) DSP1.P$63(DR1PRI) DSP1.P$64(RFS1) DSP1.P$65(RSCLK1) DSP1.P$77(TMR2) DSP1.P$78(TMR1) DSP1.P$79(TMR0) DSP1.P$119(BG_) DSP1.P$120(BGH_) DSP1.P$123(ADDR17) DSP1.P$124(ADDR16) DSP1.P$125(ADDR15) DSP1.P$126(ADDR14) DSP1.P$136(ADDR11) DSP1.P$152(AWE_) DSP1.P$153(ARE_) DSP1.P$154(AOE_) DSP1.P$158(AMS3_) DSP1.P$159(AMS2_) DSP1.P$160(AMS1_) DSP1.P$161(AMS0_) JP3.3 U23.40(NC)

### Notes on the sheet
- BMODE0 = GND /// BMODE1 = VCC
- JTAG
- CUT
- ee-68 p10

## Sheet 5 of 9
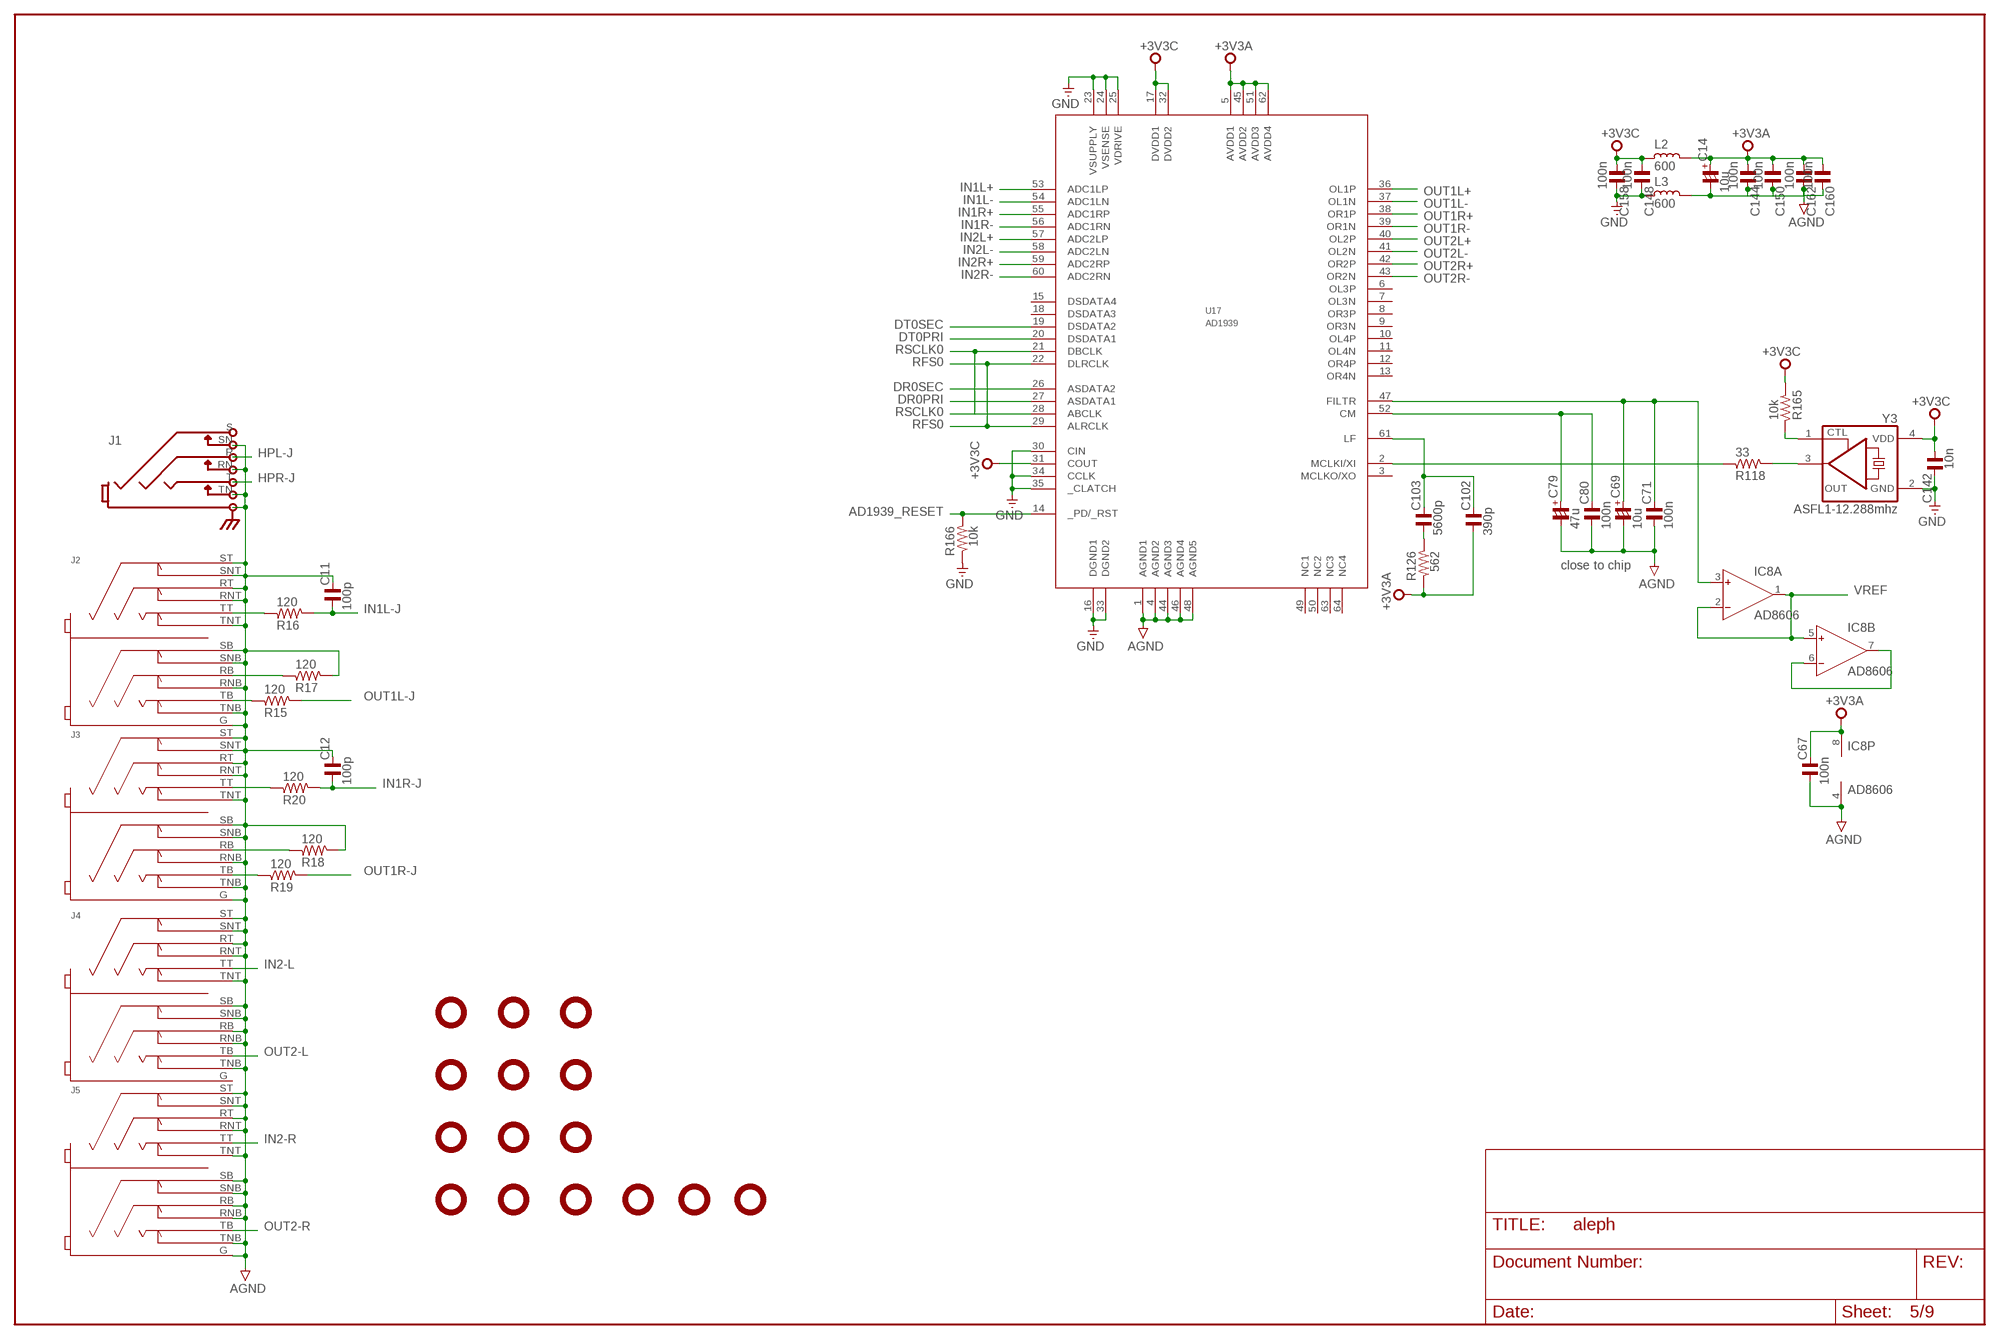
[diagram p5: schematic, sheet 5]

### Parts
C11  100p  C_0603  [C0603]
C12  100p  C_0603  [C0603]
C14  10u  CP_1206/T  [C1206/T]
C67  100n  C_0603  [C0603]
C69  10u  CP_1206/T  [C1206/T]
C71  100n  C_0603  [C0603]
C79  47u  CP_1206/T  [C1206/T]
C80  100n  C_0603  [C0603]
C102  390p  C_0603  [C0603]
C103  5600p  C_0603  [C0603]
C142  10n  C_0603  [C0603]
C144  100n  C_0603  [C0603]
C148  100n  C_0603  [C0603]
C150  100n  C_0603  [C0603]
C158  100n  C_0603  [C0603]
C160  100n  C_0603  [C0603]
C162  100n  C_0603  [C0603]
H1  MOUNT440  [120-PAD-NS]
H2  MOUNT440  [120-PAD-NS]
H3  MOUNT440  [120-PAD-NS]
H4  MOUNT440  [120-PAD-NS]
H5  MOUNT440  [120-PAD-NS]
H6  MOUNT440  [120-PAD-NS]
H7  MOUNT440  [120-PAD-NS]
H8  MOUNT440  [120-PAD-NS]
H9  MOUNT440  [120-PAD-NS]
H10  MOUNT440  [120-PAD-NS]
H11  MOUNT440  [120-PAD-NS]
H12  MOUNT440  [120-PAD-NS]
H13  MOUNT440  [120-PAD-NS]
H14  MOUNT440  [120-PAD-NS]
H15  MOUNT440  [120-PAD-NS]
IC8  AD8606  AD8607R  [SO8]
J1  STEREOSW3GND  [NEUTRIK-NRJ6HF-1]
J2  NSJ12HF  [NSJ12HF]
J3  NSJ12HF  [NSJ12HF]
J4  NSJ12HF  [NSJ12HF]
J5  NSJ12HF  [NSJ12HF]
L2  600  L_0603  [L0603]
L3  600  L_0603  [L0603]
R15  120  R_0603  [R0603]
R16  120  R_0603  [R0603]
R17  120  R_0603  [R0603]
R18  120  R_0603  [R0603]
R19  120  R_0603  [R0603]
R20  120  R_0603  [R0603]
R118  33  R_0603  [R0603]
R126  562  R_0603  [R0603]
R165  10k  R_0603  [R0603]
R166  10k  R_0603  [R0603]
U17  AD1939  [SQFP-S-10X10-64]
Y3  ASFL1-12.288mhz  ASFL1  [ASFL1]

### Nets
+3V3A: C14.+ C67.2 C102.1 C144.1 C150.1 C160.1 C162.1 IC8.8(P:V+) L2.1 R126.2 U17.5(AVDD1) U17.45(AVDD2) U17.51(AVDD3) U17.62(AVDD4) ; also sheet 7,8
+3V3C: C142.1 C148.1 C158.1 L2.2 R165.2 U17.17(DVDD1) U17.31(COUT) U17.32(DVDD2) Y3.4(VDD) ; also sheet 4,6
AD1939_RESET: R166.1 U17.14(_PD/_RST) ; also sheet 4
AGND: C11.2 C12.2 C14.- C67.1 C69.- C71.1 C79.- C80.1 C144.2 C150.2 C160.2 C162.2 IC8.4(P:V-) J1.RN J1.SN J1.TN J2.G J2.RNB J2.RNT J2.RT J2.SB J2.SNB J2.SNT J2.ST J2.TNB J2.TNT J3.G J3.RNB J3.RNT J3.RT J3.SB J3.SNB J3.SNT J3.ST J3.TNB J3.TNT J4.RB J4.RNB J4.RNT J4.RT J4.SB J4.SNB J4.SNT J4.ST J4.TNB J4.TNT J5.G J5.RB J5.RNB J5.RNT J5.RT J5.SB J5.SNB J5.SNT J5.ST J5.TNB J5.TNT L3.1 R17.2 R18.2 U17.1(AGND1) U17.4(AGND2) U17.44(AGND3) U17.46(AGND4) U17.48(AGND5) ; also sheet 3,6,7,8,9
DR0PRI: U17.27(ASDATA1) ; also sheet 4
DR0SEC: U17.26(ASDATA2) ; also sheet 4
DT0PRI: U17.20(DSDATA1) ; also sheet 4
DT0SEC: U17.19(DSDATA2) ; also sheet 4
GND: C142.2 C148.2 C158.2 L3.2 R166.2 U17.16(DGND1) U17.23(VSUPPLY) U17.24(VSENSE) U17.25(VDRIVE) U17.30(CIN) U17.33(DGND2) U17.34(CCLK) U17.35(_CLATCH) Y3.2(GND) ; also sheet 1,2,3,4
HPL-J: J1.R ; also sheet 7
HPR-J: J1.T ; also sheet 7
IN1L+: U17.53(ADC1LP) ; also sheet 8
IN1L-: U17.54(ADC1LN) ; also sheet 8
IN1L-J: C11.1 R16.2 ; also sheet 6
IN1R+: U17.55(ADC1RP) ; also sheet 8
IN1R-: U17.56(ADC1RN) ; also sheet 8
IN1R-J: C12.1 R20.2 ; also sheet 6
IN2-L: J4.TT ; also sheet 8
IN2-R: J5.TT ; also sheet 8
IN2L+: U17.57(ADC2LP) ; also sheet 8
IN2L-: U17.58(ADC2LN) ; also sheet 8
IN2R+: U17.59(ADC2RP) ; also sheet 8
IN2R-: U17.60(ADC2RN) ; also sheet 8
N$36: R165.1 Y3.1(CTL)
N$57: R118.2 Y3.3(OUT)
N$59: R118.1 U17.2(MCLKI/XI)
N$61: C69.+ C71.2 IC8.3(A:IN+) U17.47(FILTR)
N$62: C79.+ C80.2 U17.52(CM)
N$63: C102.2 C103.2 U17.61(LF)
N$65: C103.1 R126.1
N$122: J3.TB R19.1
N$130: J3.RB R18.1
N$131: IC8.6(B:IN-) IC8.7(B:OUT)
N$140: J2.TB R15.1
N$156: J2.RB R17.1
N$157: J3.TT R20.1
N$170: J2.TT R16.1
OUT1L+: U17.36(OL1P) ; also sheet 7
OUT1L-: U17.37(OL1N) ; also sheet 7
OUT1L-J: R15.2 ; also sheet 6
OUT1R+: U17.38(OR1P) ; also sheet 7
OUT1R-: U17.39(OR1N) ; also sheet 7
OUT1R-J: R19.2 ; also sheet 6
OUT2-L: J4.TB ; also sheet 7
OUT2-R: J5.TB ; also sheet 7
OUT2L+: U17.40(OL2P) ; also sheet 7
OUT2L-: U17.41(OL2N) ; also sheet 7
OUT2R+: U17.42(OR2P) ; also sheet 7
OUT2R-: U17.43(OR2N) ; also sheet 7
RFS0: U17.22(DLRCLK) U17.29(ALRCLK) ; also sheet 4
RSCLK0: U17.21(DBCLK) U17.28(ABCLK) ; also sheet 4
VREF: IC8.1(A:OUT) IC8.2(A:IN-) IC8.5(B:IN+) ; also sheet 7,8
Unconnected: J1.S J4.G U17.3(MCLKO/XO) U17.6(OL3P) U17.7(OL3N) U17.8(OR3P) U17.9(OR3N) U17.10(OL4P) U17.11(OL4N) U17.12(OR4P) U17.13(OR4N) U17.15(DSDATA4) U17.18(DSDATA3) U17.49(NC1) U17.50(NC2) U17.63(NC3) U17.64(NC4)

### Notes on the sheet
- close to chip

## Sheet 6 of 9
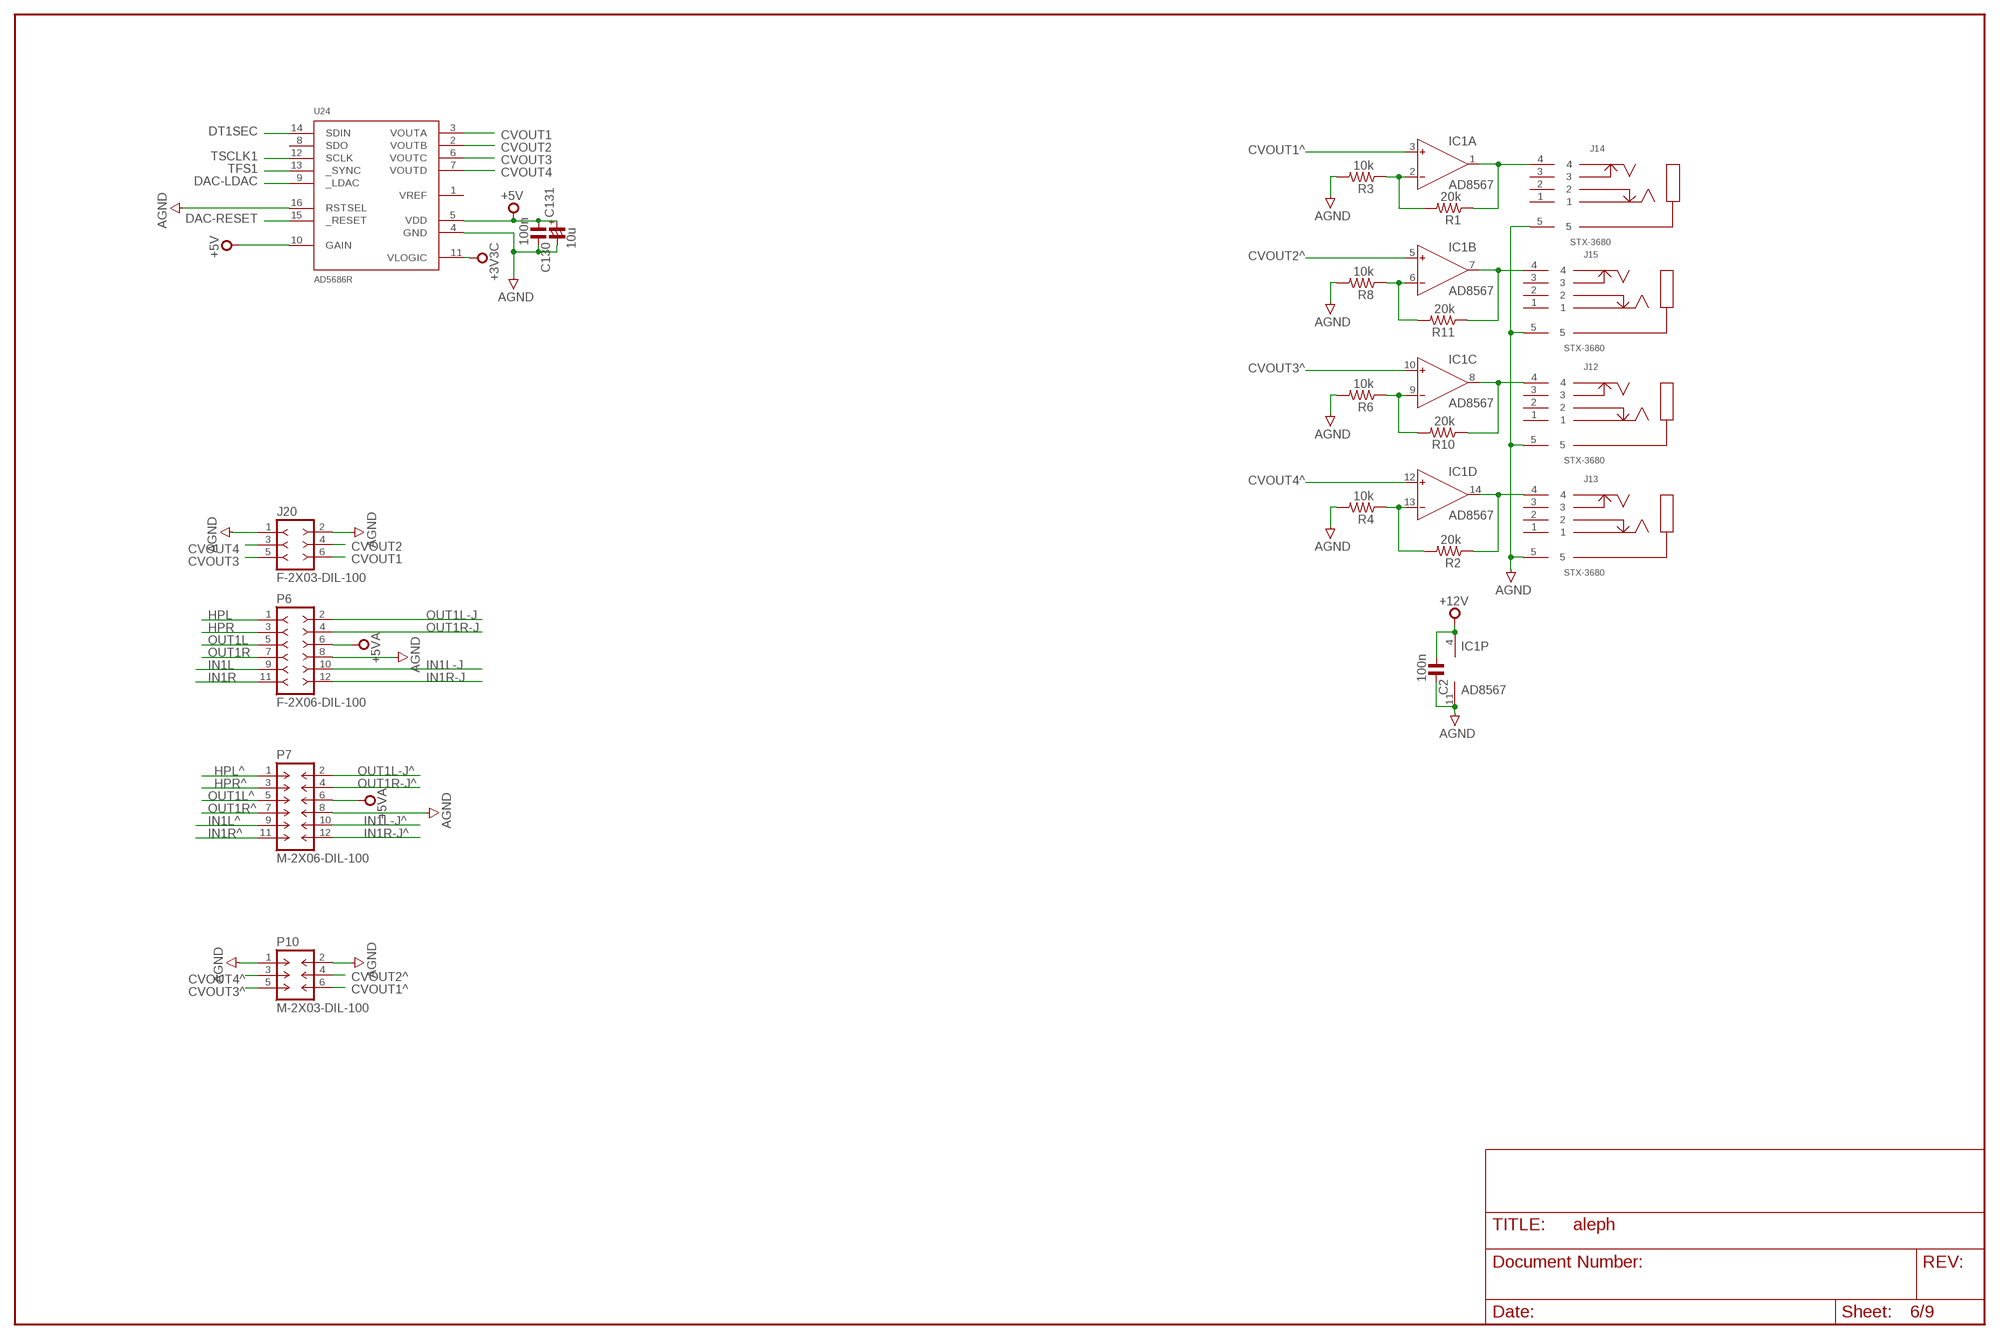
[diagram p6: schematic, sheet 6]

### Parts
C2  100n  C_0603  [C0603]
C130  100n  C_0603  [C0603]
C131  10u  CP_1206/T  [C1206/T]
IC1  AD8567  AD8544RU  [TSSOP14]
J12  STX-3680  [STX-3680]
J13  STX-3680  [STX-3680]
J14  STX-3680  [STX-3680]
J15  STX-3680  [STX-3680]
J20  F-2X03-DIL-100  [DIL-100-2X03]
P6  F-2X06-DIL-100  [DIL-100-2X06]
P7  M-2X06-DIL-100  [DIL-100-2X06]
P10  M-2X03-DIL-100  [DIL-100-2X03]
R1  20k  R_0603  [R0603]
R2  20k  R_0603  [R0603]
R3  10k  R_0603  [R0603]
R4  10k  R_0603  [R0603]
R6  10k  R_0603  [R0603]
R8  10k  R_0603  [R0603]
R10  20k  R_0603  [R0603]
R11  20k  R_0603  [R0603]
U24  AD5686R  [TSSOP16]

### Nets
+3V3C: U24.11(VLOGIC) ; also sheet 4,5
+5V: C130.1 C131.+ U24.5(VDD) U24.10(GAIN) ; also sheet 2,3,4
+5VA: P6.6 P7.6 ; also sheet 2,3,7,9
+12V: C2.1 IC1.4(P:V+) ; also sheet 2,3
AGND: C2.2 C130.2 C131.- IC1.11(P:V-) J12.5 J13.5 J14.5 J15.5 J20.1 J20.2 P6.8 P7.8 P10.1 P10.2 R3.2 R4.2 R6.2 R8.2 U24.4(GND) U24.16(RSTSEL) ; also sheet 3,5,7,8,9
CVOUT1: J20.6 U24.3(VOUTA)
CVOUT1^: IC1.3(A:IN+) P10.6
CVOUT2: J20.4 U24.2(VOUTB)
CVOUT2^: IC1.5(B:IN+) P10.4
CVOUT3: J20.5 U24.6(VOUTC)
CVOUT3^: IC1.10(C:IN+) P10.5
CVOUT4: J20.3 U24.7(VOUTD)
CVOUT4^: IC1.12(D:IN+) P10.3
DAC-LDAC: U24.9(_LDAC) ; also sheet 4
DAC-RESET: U24.15(_RESET) ; also sheet 4
DT1SEC: U24.14(SDIN) ; also sheet 4
HPL: P6.1 ; also sheet 7
HPL^: P7.1 ; also sheet 7
HPR: P6.3 ; also sheet 7
HPR^: P7.3 ; also sheet 7
IN1L: P6.9 ; also sheet 8
IN1L-J: P6.10 ; also sheet 5
IN1L-J^: P7.10 ; also sheet 9
IN1L^: P7.9 ; also sheet 9
IN1R: P6.11 ; also sheet 8
IN1R-J: P6.12 ; also sheet 5
IN1R-J^: P7.12 ; also sheet 9
IN1R^: P7.11 ; also sheet 9
N$1: IC1.2(A:IN-) R1.2 R3.1
N$56: IC1.1(A:OUT) J14.4 R1.1
N$132: IC1.6(B:IN-) R8.1 R11.2
N$135: IC1.9(C:IN-) R6.1 R10.2
N$136: IC1.13(D:IN-) R2.2 R4.1
N$137: IC1.8(C:OUT) J12.4 R10.1
N$138: IC1.14(D:OUT) J13.4 R2.1
N$139: IC1.7(B:OUT) J15.4 R11.1
OUT1L: P6.5 ; also sheet 7
OUT1L-J: P6.2 ; also sheet 5
OUT1L-J^: P7.2 ; also sheet 7
OUT1L^: P7.5 ; also sheet 7
OUT1R: P6.7 ; also sheet 7
OUT1R-J: P6.4 ; also sheet 5
OUT1R-J^: P7.4 ; also sheet 7
OUT1R^: P7.7 ; also sheet 7
TFS1: U24.13(_SYNC) ; also sheet 4
TSCLK1: U24.12(SCLK) ; also sheet 4
Unconnected: J12.1 J12.2 J12.3 J13.1 J13.2 J13.3 J14.1 J14.2 J14.3 J15.1 J15.2 J15.3 U24.1(VREF) U24.8(SDO)

## Sheet 7 of 9
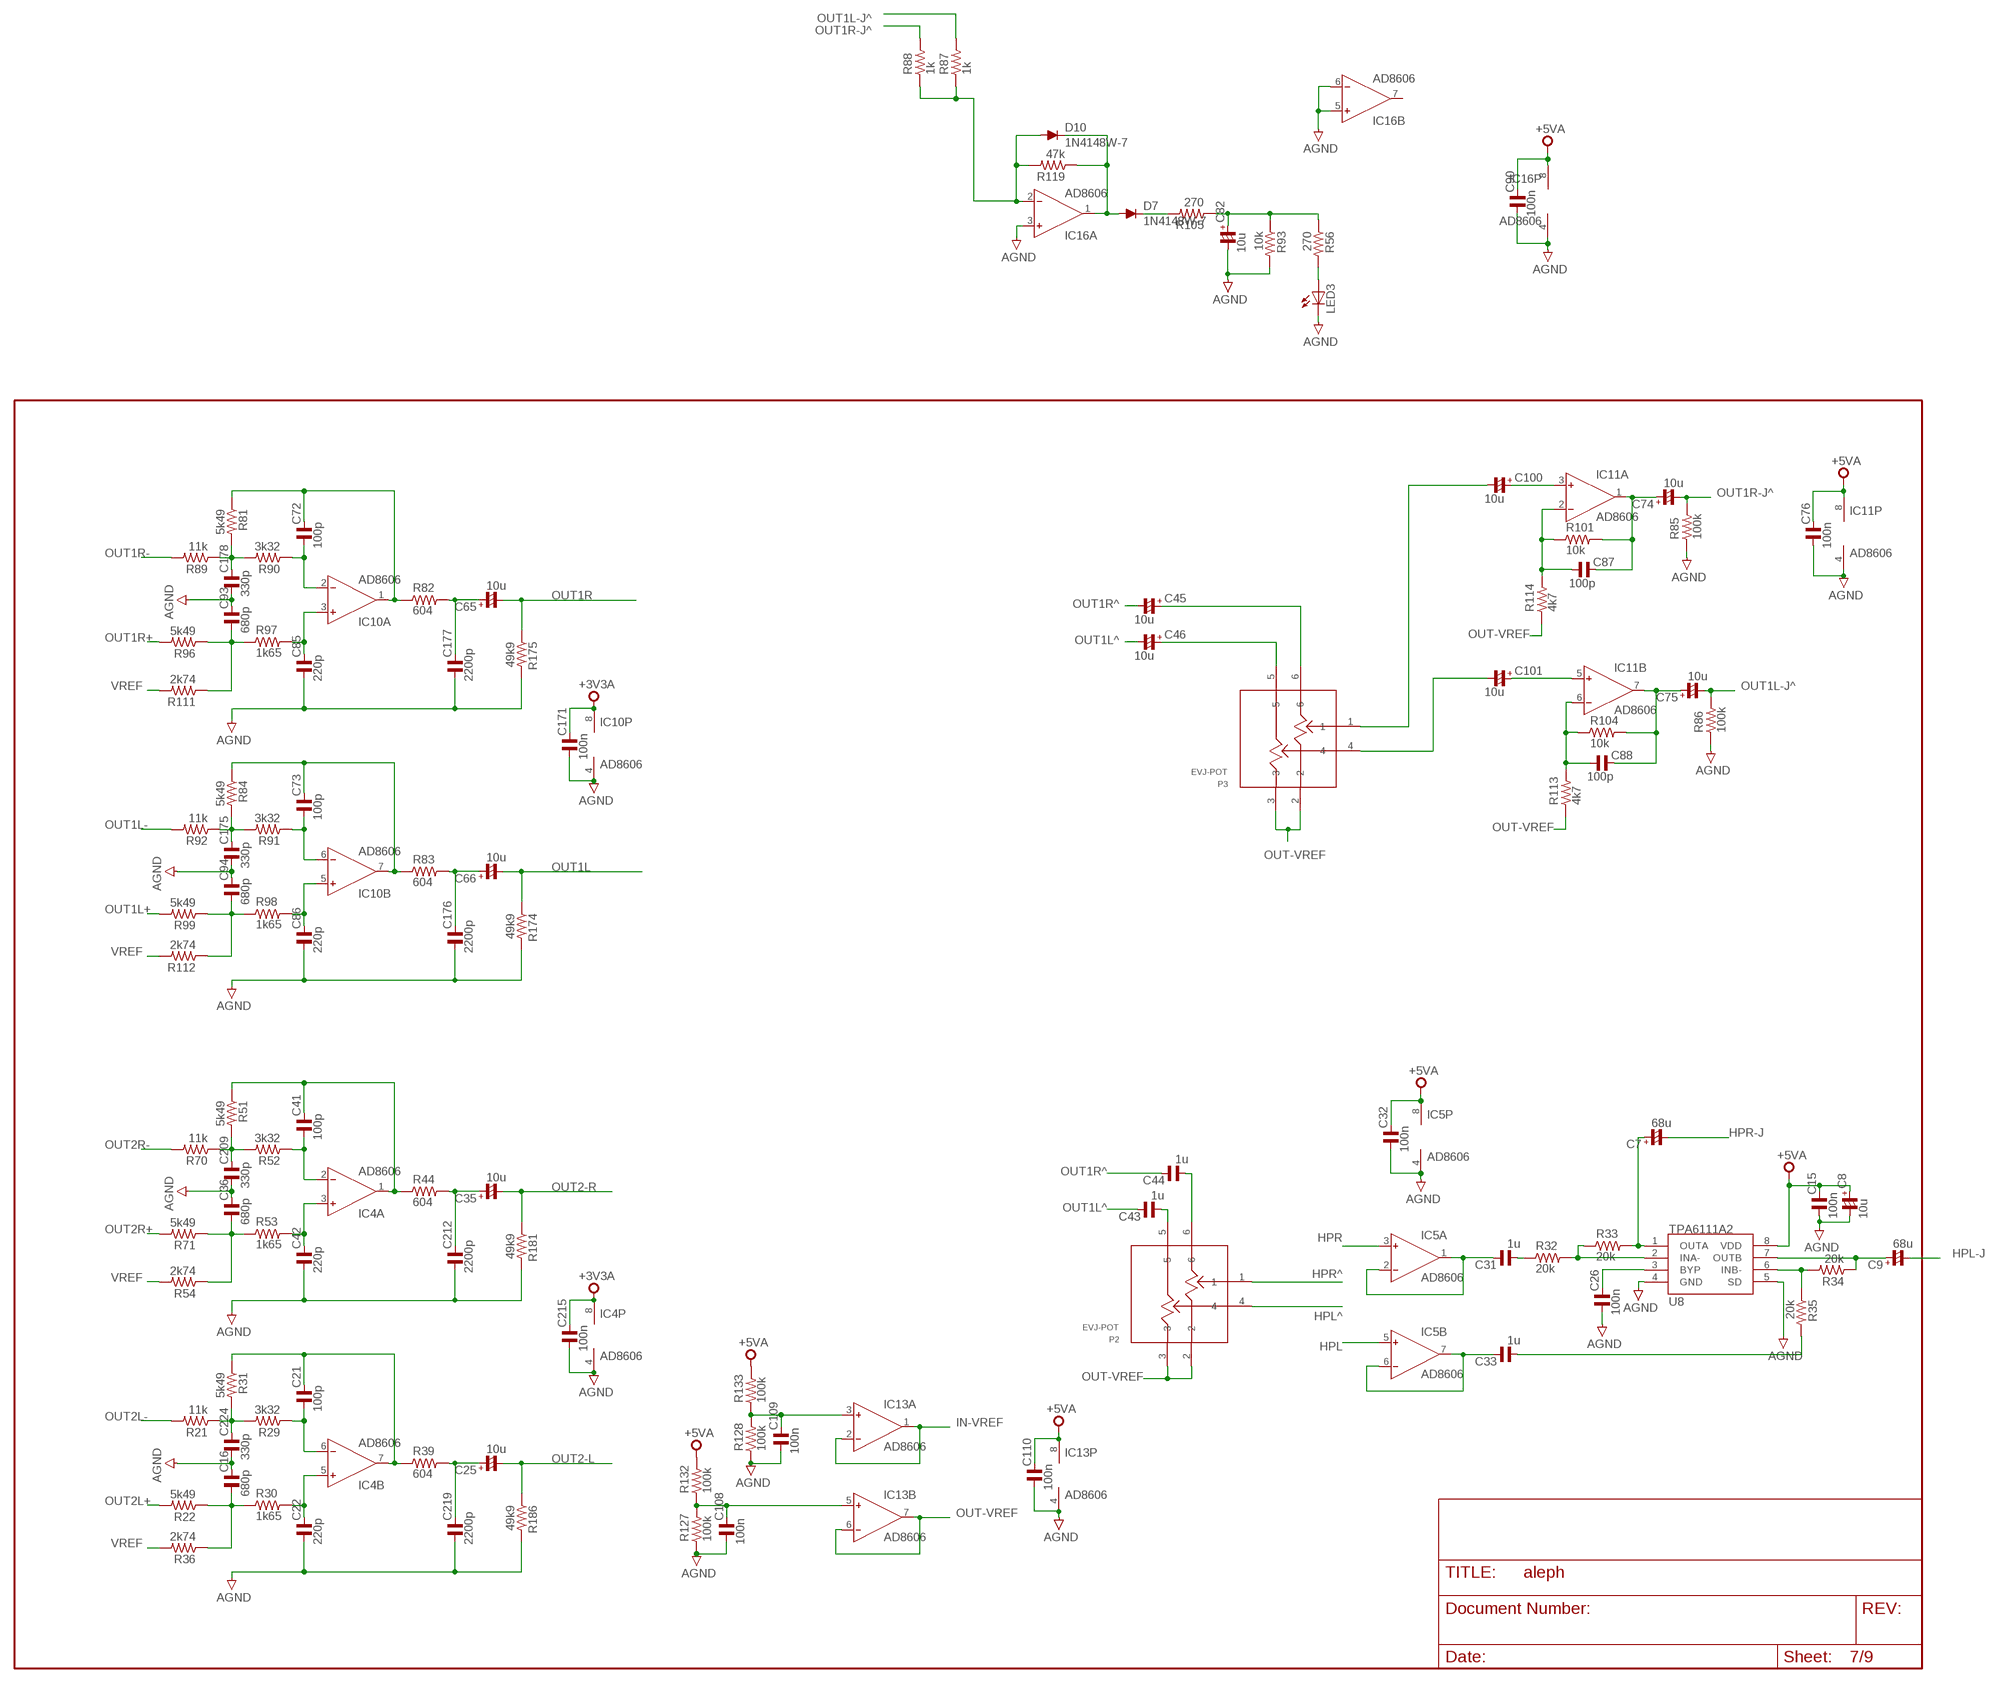
[diagram p7: schematic, sheet 7]

### Parts
C7  68u  CP_1206/T  [C1206/T]
C8  10u  CP_1206/T  [C1206/T]
C9  68u  CP_1206/T  [C1206/T]
C15  100n  C_0603  [C0603]
C16  680p  C_0603  [C0603]
C21  100p  C_0603  [C0603]
C22  220p  C_0603  [C0603]
C25  10u  CP_1206/T  [C1206/T]
C26  100n  C_0603  [C0603]
C31  1u  C_0603  [C0603]
C32  100n  C_0603  [C0603]
C33  1u  C_0603  [C0603]
C35  10u  CP_1206/T  [C1206/T]
C36  680p  C_0603  [C0603]
C41  100p  C_0603  [C0603]
C42  220p  C_0603  [C0603]
C43  1u  C_0603  [C0603]
C44  1u  C_0603  [C0603]
C45  10u  CP_1206/T  [C1206/T]
C46  10u  CP_1206/T  [C1206/T]
C65  10u  CP_1206/T  [C1206/T]
C66  10u  CP_1206/T  [C1206/T]
C72  100p  C_0603  [C0603]
C73  100p  C_0603  [C0603]
C74  10u  CP_1206/T  [C1206/T]
C75  10u  CP_1206/T  [C1206/T]
C76  100n  C_0603  [C0603]
C82  10u  CP_1206/T  [C1206/T]
C85  220p  C_0603  [C0603]
C86  220p  C_0603  [C0603]
C87  100p  C_0603  [C0603]
C88  100p  C_0603  [C0603]
C90  100n  C_0603  [C0603]
C93  680p  C_0603  [C0603]
C94  680p  C_0603  [C0603]
C100  10u  CP_1206/T  [C1206/T]
C101  10u  CP_1206/T  [C1206/T]
C108  100n  C_0603  [C0603]
C109  100n  C_0603  [C0603]
C110  100n  C_0603  [C0603]
C171  100n  C_0603  [C0603]
C175  330p  C_0603  [C0603]
C176  2200p  C_0603  [C0603]
C177  2200p  C_0603  [C0603]
C178  330p  C_0603  [C0603]
C209  330p  C_0603  [C0603]
C212  2200p  C_0603  [C0603]
C215  100n  C_0603  [C0603]
C219  2200p  C_0603  [C0603]
C224  330p  C_0603  [C0603]
D7  1N4148W-7  [SOD123]
D10  1N4148W-7  [SOD123]
IC4  AD8606  AD8607R  [SO8]
IC5  AD8606  AD8607R  [SO8]
IC10  AD8606  AD8607R  [SO8]
IC11  AD8606  AD8607R  [SO8]
IC13  AD8606  AD8607R  [SO8]
IC16  AD8606  AD8607R  [SO8]
LED3  LEDCHIPLED_0805  [CHIPLED_0805]
P2  EVJ-POT  [EVJ-POT]
P3  EVJ-POT  [EVJ-POT]
R21  11k  R_0603  [R0603]
R22  5k49  R_0603  [R0603]
R29  3k32  R_0603  [R0603]
R30  1k65  R_0603  [R0603]
R31  5k49  R_0603  [R0603]
R32  20k  R_0603  [R0603]
R33  20k  R_0603  [R0603]
R34  20k  R_0603  [R0603]
R35  20k  R_0603  [R0603]
R36  2k74  R_0603  [R0603]
R39  604  R_0603  [R0603]
R44  604  R_0603  [R0603]
R51  5k49  R_0603  [R0603]
R52  3k32  R_0603  [R0603]
R53  1k65  R_0603  [R0603]
R54  2k74  R_0603  [R0603]
R56  270  R_0603  [R0603]
R70  11k  R_0603  [R0603]
R71  5k49  R_0603  [R0603]
R81  5k49  R_0603  [R0603]
R82  604  R_0603  [R0603]
R83  604  R_0603  [R0603]
R84  5k49  R_0603  [R0603]
R85  100k  R_0603  [R0603]
R86  100k  R_0603  [R0603]
R87  1k  R_0603  [R0603]
R88  1k  R_0603  [R0603]
R89  11k  R_0603  [R0603]
R90  3k32  R_0603  [R0603]
R91  3k32  R_0603  [R0603]
R92  11k  R_0603  [R0603]
R93  10k  R_0603  [R0603]
R96  5k49  R_0603  [R0603]
R97  1k65  R_0603  [R0603]
R98  1k65  R_0603  [R0603]
R99  5k49  R_0603  [R0603]
R101  10k  R_0603  [R0603]
R104  10k  R_0603  [R0603]
R105  270  R_0603  [R0603]
R111  2k74  R_0603  [R0603]
R112  2k74  R_0603  [R0603]
R113  4k7  R_0603  [R0603]
R114  4k7  R_0603  [R0603]
R119  47k  R_0603  [R0603]
R127  100k  R_0603  [R0603]
R128  100k  R_0603  [R0603]
R132  100k  R_0603  [R0603]
R133  100k  R_0603  [R0603]
R174  49k9  R_0603  [R0603]
R175  49k9  R_0603  [R0603]
R181  49k9  R_0603  [R0603]
R186  49k9  R_0603  [R0603]
U8  TPA6111A2  [SO08]

### Nets
+3V3A: C171.2 C215.2 IC4.8(P:V+) IC10.8(P:V+) ; also sheet 5,8
+5VA: C8.+ C15.2 C32.2 C76.2 C90.2 C110.2 IC5.8(P:V+) IC11.8(P:V+) IC13.8(P:V+) IC16.8(P:V+) R132.2 R133.2 U8.8(VDD) ; also sheet 2,3,6,9
AGND: C8.- C15.1 C16.2 C22.1 C26.1 C32.1 C36.2 C42.1 C76.1 C82.- C85.1 C86.1 C90.1 C93.2 C94.2 C108.1 C109.1 C110.1 C171.1 C175.1 C176.1 C177.1 C178.1 C209.1 C212.1 C215.1 C219.1 C224.1 IC4.4(P:V-) IC5.4(P:V-) IC10.4(P:V-) IC11.4(P:V-) IC13.4(P:V-) IC16.3(A:IN+) IC16.4(P:V-) IC16.5(B:IN+) IC16.6(B:IN-) LED3.C R85.1 R86.1 R93.2 R127.1 R128.1 R174.2 R175.2 R181.2 R186.2 U8.4(GND) U8.5(SD) ; also sheet 3,5,6,8,9
HPL: IC5.5(B:IN+) ; also sheet 6
HPL-J: C9.- ; also sheet 5
HPL^: P2.4 ; also sheet 6
HPR: IC5.3(A:IN+) ; also sheet 6
HPR-J: C7.- ; also sheet 5
HPR^: P2.1 ; also sheet 6
IN-VREF: IC13.1(A:OUT) IC13.2(A:IN-) ; also sheet 9
N$33: C45.+ P3.6
N$41: C46.+ P3.5
N$47: C100.- P3.1
N$51: C101.+ IC11.5(B:IN+)
N$68: C178.2 R81.2 R89.1 R90.2
N$69: C93.1 R96.1 R97.1 R111.1
N$70: C85.2 IC10.3(A:IN+) R97.2
N$71: C72.2 IC10.1(A:OUT) R81.1 R82.1
N$72: C65.+ C177.2 R82.2
N$73: C175.2 R84.2 R91.2 R92.1
N$74: C72.1 IC10.2(A:IN-) R90.1
N$75: C94.1 R98.1 R99.1 R112.1
N$76: C86.2 IC10.5(B:IN+) R98.2
N$77: C73.2 IC10.7(B:OUT) R83.1 R84.1
N$78: C66.+ C176.2 R83.2
N$79: C73.1 IC10.6(B:IN-) R91.1
N$80: C209.2 R51.2 R52.2 R70.1
N$81: C36.1 R53.1 R54.1 R71.1
N$82: C42.2 IC4.3(A:IN+) R53.2
N$83: C41.2 IC4.1(A:OUT) R44.1 R51.1
N$84: C35.+ C212.2 R44.2
N$85: C41.1 IC4.2(A:IN-) R52.1
N$86: C224.2 R21.1 R29.2 R31.2
N$87: C16.1 R22.1 R30.1 R36.1
N$88: C22.2 IC4.5(B:IN+) R30.2
N$89: C75.+ C88.2 IC11.7(B:OUT) R104.2
N$90: C88.1 IC11.6(B:IN-) R104.1 R113.2
N$91: C101.- P3.4
N$92: C21.2 IC4.7(B:OUT) R31.1 R39.1
N$93: C100.+ IC11.3(A:IN+)
N$94: C25.+ C219.2 R39.2
N$95: C21.1 IC4.6(B:IN-) R29.1
N$102: C74.+ C87.2 IC11.1(A:OUT) R101.2
N$103: C87.1 IC11.2(A:IN-) R101.1 R114.2
N$107: C26.2 U8.3(BYP)
N$111: C31.2 IC5.1(A:OUT) IC5.2(A:IN-)
N$113: C33.2 IC5.6(B:IN-) IC5.7(B:OUT)
N$114: C33.1 R35.2
N$115: C31.1 R32.1
N$141: R32.2 R33.1 U8.2(INA-)
N$148: C7.+ R33.2 U8.1(OUTA)
N$149: C43.1 P2.5
N$150: R34.2 R35.1 U8.6(INB-)
N$151: C44.1 P2.6
N$152: C109.2 IC13.3(A:IN+) R128.2 R133.1
N$154: C9.+ R34.1 U8.7(OUTB)
N$163: C108.2 IC13.5(B:IN+) R127.2 R132.1
N$195: D10.A IC16.2(A:IN-) R87.1 R88.1 R119.2
N$196: D7.A D10.C IC16.1(A:OUT) R119.1
N$197: D7.C R105.2
N$198: C82.+ R56.1 R93.1 R105.1
N$200: LED3.A R56.2
OUT1L: C66.- R174.1 ; also sheet 6
OUT1L+: R99.2 ; also sheet 5
OUT1L-: R92.2 ; also sheet 5
OUT1L-J^: C75.- R86.2 R87.2 ; also sheet 6
OUT1L^: C43.2 C46.- ; also sheet 6
OUT1R: C65.- R175.1 ; also sheet 6
OUT1R+: R96.2 ; also sheet 5
OUT1R-: R89.2 ; also sheet 5
OUT1R-J^: C74.- R85.2 R88.2 ; also sheet 6
OUT1R^: C44.2 C45.- ; also sheet 6
OUT2-L: C25.- R186.1 ; also sheet 5
OUT2-R: C35.- R181.1 ; also sheet 5
OUT2L+: R22.2 ; also sheet 5
OUT2L-: R21.2 ; also sheet 5
OUT2R+: R71.2 ; also sheet 5
OUT2R-: R70.2 ; also sheet 5
OUT-VREF: IC13.6(B:IN-) IC13.7(B:OUT) P2.2 P2.3 P3.2 P3.3 R113.1 R114.1
VREF: R36.2 R54.2 R111.2 R112.2 ; also sheet 5,8
Unconnected: IC16.7(B:OUT)

## Sheet 8 of 9
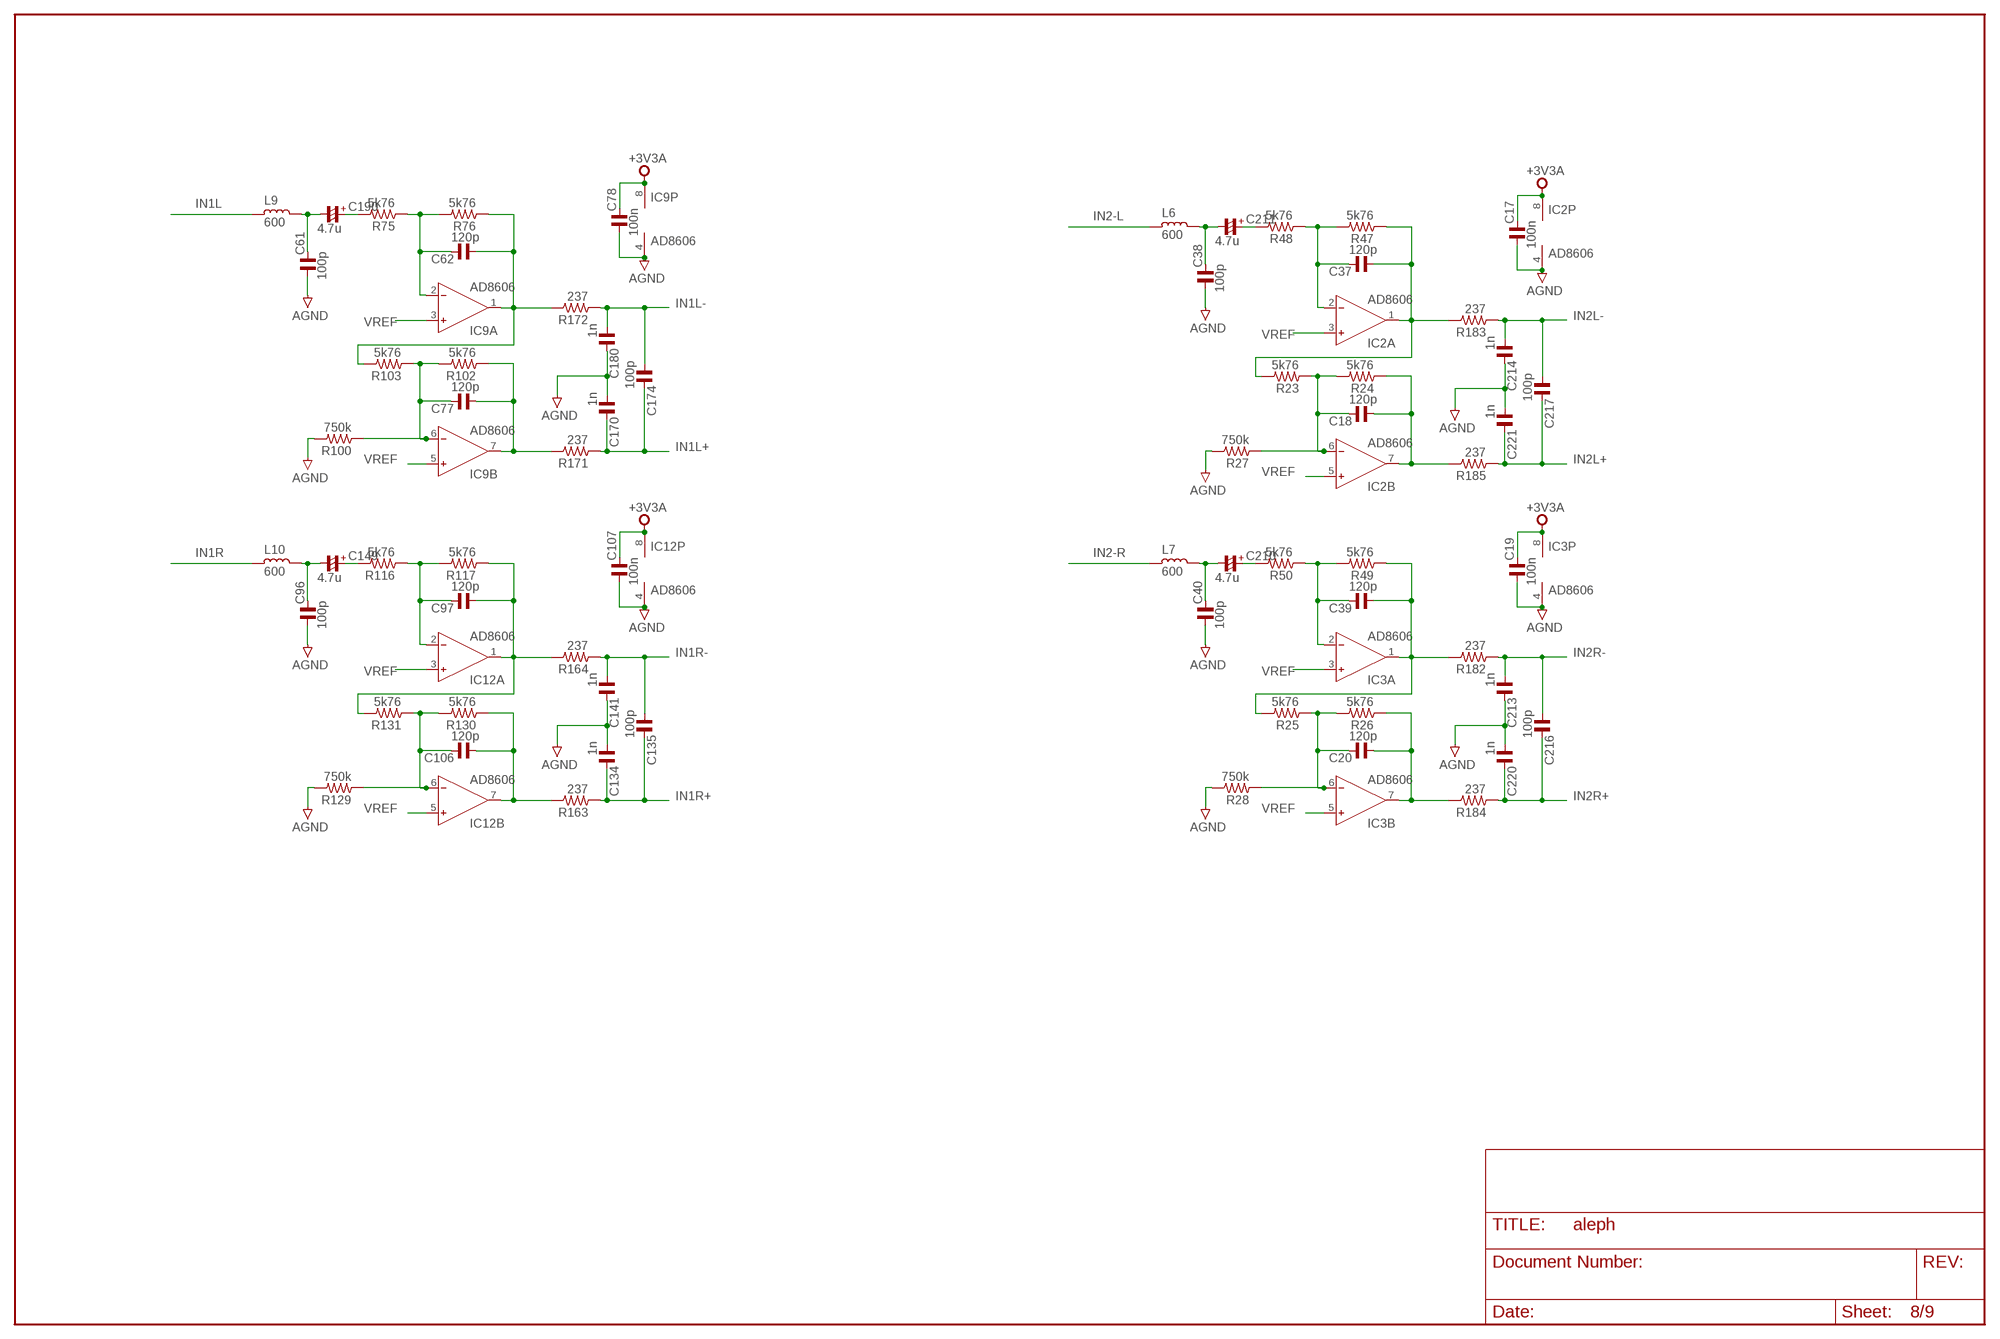
[diagram p8: schematic, sheet 8]

### Parts
C17  100n  C_0603  [C0603]
C18  120p  C_0603  [C0603]
C19  100n  C_0603  [C0603]
C20  120p  C_0603  [C0603]
C37  120p  C_0603  [C0603]
C38  100p  C_0603  [C0603]
C39  120p  C_0603  [C0603]
C40  100p  C_0603  [C0603]
C61  100p  C_0603  [C0603]
C62  120p  C_0603  [C0603]
C77  120p  C_0603  [C0603]
C78  100n  C_0603  [C0603]
C96  100p  C_0603  [C0603]
C97  120p  C_0603  [C0603]
C106  120p  C_0603  [C0603]
C107  100n  C_0603  [C0603]
C134  1n  C_0603  [C0603]
C135  100p  C_0603  [C0603]
C141  1n  C_0603  [C0603]
C149  4.7u  CP_1206/T  [C1206/T]
C170  1n  C_0603  [C0603]
C174  100p  C_0603  [C0603]
C180  1n  C_0603  [C0603]
C190  4.7u  CP_1206/T  [C1206/T]
C210  4.7u  CP_1206/T  [C1206/T]
C211  4.7u  CP_1206/T  [C1206/T]
C213  1n  C_0603  [C0603]
C214  1n  C_0603  [C0603]
C216  100p  C_0603  [C0603]
C217  100p  C_0603  [C0603]
C220  1n  C_0603  [C0603]
C221  1n  C_0603  [C0603]
IC2  AD8606  AD8607R  [SO8]
IC3  AD8606  AD8607R  [SO8]
IC9  AD8606  AD8607R  [SO8]
IC12  AD8606  AD8607R  [SO8]
L6  600  L_0603  [L0603]
L7  600  L_0603  [L0603]
L9  600  L_0603  [L0603]
L10  600  L_0603  [L0603]
R23  5k76  R_0603  [R0603]
R24  5k76  R_0603  [R0603]
R25  5k76  R_0603  [R0603]
R26  5k76  R_0603  [R0603]
R27  750k  R_0603  [R0603]
R28  750k  R_0603  [R0603]
R47  5k76  R_0603  [R0603]
R48  5k76  R_0603  [R0603]
R49  5k76  R_0603  [R0603]
R50  5k76  R_0603  [R0603]
R75  5k76  R_0603  [R0603]
R76  5k76  R_0603  [R0603]
R100  750k  R_0603  [R0603]
R102  5k76  R_0603  [R0603]
R103  5k76  R_0603  [R0603]
R116  5k76  R_0603  [R0603]
R117  5k76  R_0603  [R0603]
R129  750k  R_0603  [R0603]
R130  5k76  R_0603  [R0603]
R131  5k76  R_0603  [R0603]
R163  237  R_0603  [R0603]
R164  237  R_0603  [R0603]
R171  237  R_0603  [R0603]
R172  237  R_0603  [R0603]
R182  237  R_0603  [R0603]
R183  237  R_0603  [R0603]
R184  237  R_0603  [R0603]
R185  237  R_0603  [R0603]

### Nets
+3V3A: C17.2 C19.2 C78.2 C107.2 IC2.8(P:V+) IC3.8(P:V+) IC9.8(P:V+) IC12.8(P:V+) ; also sheet 5,7
AGND: C17.1 C19.1 C38.1 C40.1 C61.1 C78.1 C96.1 C107.1 C134.1 C141.2 C170.1 C180.2 C213.2 C214.2 C220.1 C221.1 IC2.4(P:V-) IC3.4(P:V-) IC9.4(P:V-) IC12.4(P:V-) R27.2 R28.2 R100.2 R129.2 ; also sheet 3,5,6,7,9
IN1L: L9.2 ; also sheet 6
IN1L+: C170.2 C174.2 R171.1 ; also sheet 5
IN1L-: C174.1 C180.1 R172.1 ; also sheet 5
IN1R: L10.2 ; also sheet 6
IN1R+: C134.2 C135.2 R163.1 ; also sheet 5
IN1R-: C135.1 C141.1 R164.1 ; also sheet 5
IN2-L: L6.2 ; also sheet 5
IN2-R: L7.2 ; also sheet 5
IN2L+: C217.2 C221.2 R185.1 ; also sheet 5
IN2L-: C214.1 C217.1 R183.1 ; also sheet 5
IN2R+: C216.2 C220.2 R184.1 ; also sheet 5
IN2R-: C213.1 C216.1 R182.1 ; also sheet 5
N$53: C190.+ R75.2
N$96: C97.1 IC12.1(A:OUT) R117.1 R131.2 R164.2
N$97: C106.1 IC12.7(B:OUT) R130.1 R163.2
N$98: C96.2 C149.- L10.1
N$99: C97.2 IC12.2(A:IN-) R116.1 R117.2
N$100: C106.2 IC12.6(B:IN-) R129.1 R130.2 R131.1
N$101: C149.+ R116.2
N$104: C62.1 IC9.1(A:OUT) R76.1 R103.2 R172.2
N$105: C77.1 IC9.7(B:OUT) R102.1 R171.2
N$106: C61.2 C190.- L9.1
N$108: C62.2 IC9.2(A:IN-) R75.1 R76.2
N$110: C77.2 IC9.6(B:IN-) R100.1 R102.2 R103.1
N$123: C37.1 IC2.1(A:OUT) R23.2 R47.1 R183.2
N$125: C18.1 IC2.7(B:OUT) R24.1 R185.2
N$126: C38.2 C211.- L6.1
N$127: C37.2 IC2.2(A:IN-) R47.2 R48.1
N$128: C18.2 IC2.6(B:IN-) R23.1 R24.2 R27.1
N$129: C211.+ R48.2
N$142: C39.1 IC3.1(A:OUT) R25.2 R49.1 R182.2
N$143: C20.1 IC3.7(B:OUT) R26.1 R184.2
N$144: C40.2 C210.- L7.1
N$145: C39.2 IC3.2(A:IN-) R49.2 R50.1
N$146: C20.2 IC3.6(B:IN-) R25.1 R26.2 R28.1
N$147: C210.+ R50.2
VREF: IC2.3(A:IN+) IC2.5(B:IN+) IC3.3(A:IN+) IC3.5(B:IN+) IC9.3(A:IN+) IC9.5(B:IN+) IC12.3(A:IN+) IC12.5(B:IN+) ; also sheet 5,7

## Sheet 9 of 9
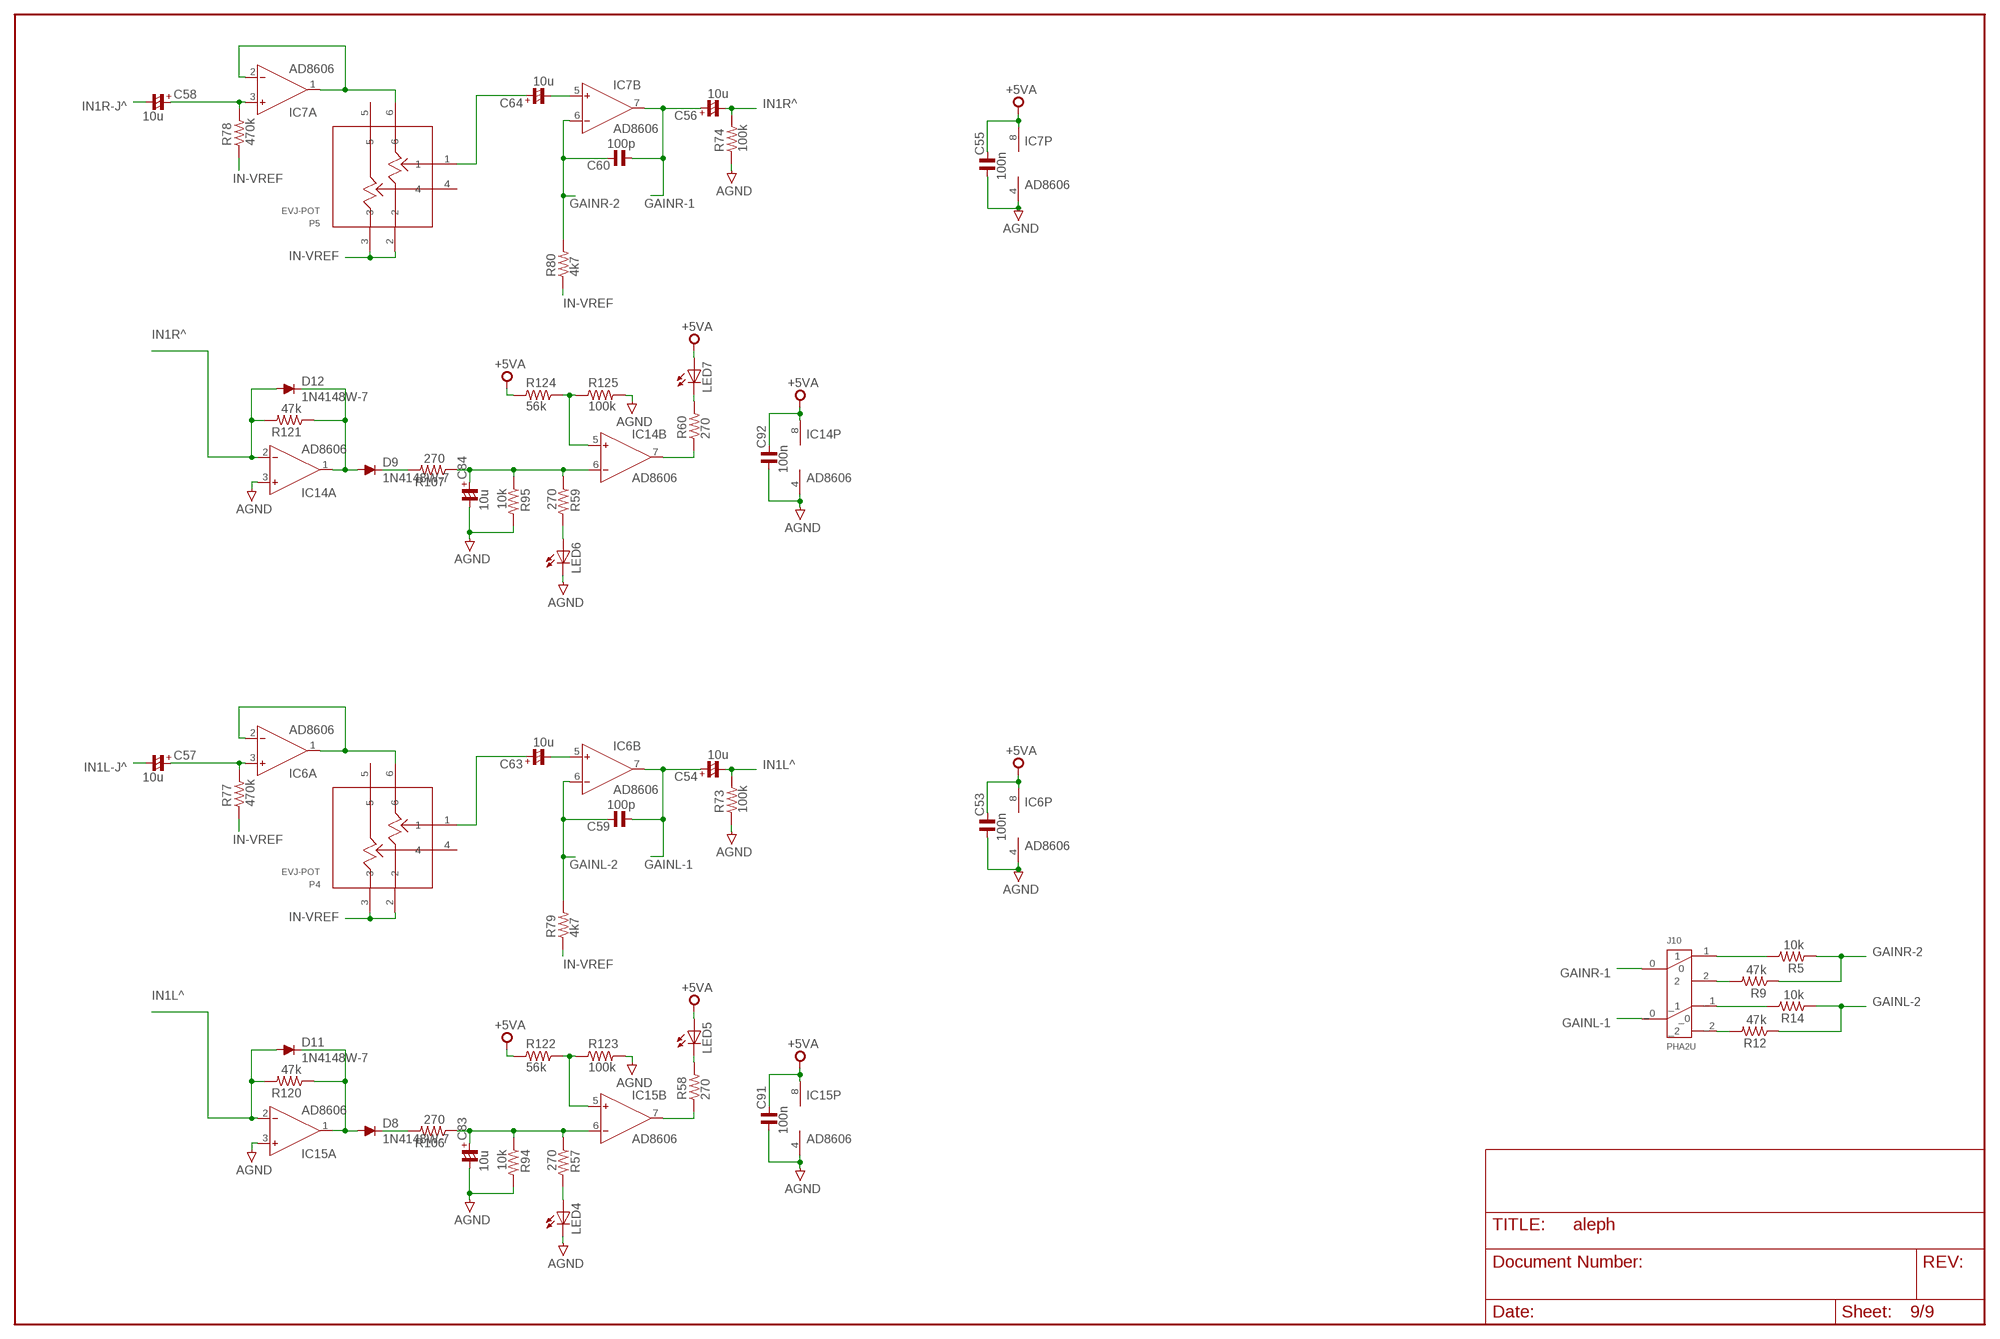
[diagram p9: schematic, sheet 9]

### Parts
C53  100n  C_0603  [C0603]
C54  10u  CP_1206/T  [C1206/T]
C55  100n  C_0603  [C0603]
C56  10u  CP_1206/T  [C1206/T]
C57  10u  CP_1206/T  [C1206/T]
C58  10u  CP_1206/T  [C1206/T]
C59  100p  C_0603  [C0603]
C60  100p  C_0603  [C0603]
C63  10u  CP_1206/T  [C1206/T]
C64  10u  CP_1206/T  [C1206/T]
C83  10u  CP_1206/T  [C1206/T]
C84  10u  CP_1206/T  [C1206/T]
C91  100n  C_0603  [C0603]
C92  100n  C_0603  [C0603]
D8  1N4148W-7  [SOD123]
D9  1N4148W-7  [SOD123]
D11  1N4148W-7  [SOD123]
D12  1N4148W-7  [SOD123]
IC6  AD8606  AD8607R  [SO8]
IC7  AD8606  AD8607R  [SO8]
IC14  AD8606  AD8607R  [SO8]
IC15  AD8606  AD8607R  [SO8]
J10  PHA2U  [PHA2U]
LED4  LEDCHIPLED_0805  [CHIPLED_0805]
LED5  LEDCHIPLED_0805  [CHIPLED_0805]
LED6  LEDCHIPLED_0805  [CHIPLED_0805]
LED7  LEDCHIPLED_0805  [CHIPLED_0805]
P4  EVJ-POT  [EVJ-POT]
P5  EVJ-POT  [EVJ-POT]
R5  10k  R_0603  [R0603]
R9  47k  R_0603  [R0603]
R12  47k  R_0603  [R0603]
R14  10k  R_0603  [R0603]
R57  270  R_0603  [R0603]
R58  270  R_0603  [R0603]
R59  270  R_0603  [R0603]
R60  270  R_0603  [R0603]
R73  100k  R_0603  [R0603]
R74  100k  R_0603  [R0603]
R77  470k  R_0603  [R0603]
R78  470k  R_0603  [R0603]
R79  4k7  R_0603  [R0603]
R80  4k7  R_0603  [R0603]
R94  10k  R_0603  [R0603]
R95  10k  R_0603  [R0603]
R106  270  R_0603  [R0603]
R107  270  R_0603  [R0603]
R120  47k  R_0603  [R0603]
R121  47k  R_0603  [R0603]
R122  56k  R_0603  [R0603]
R123  100k  R_0603  [R0603]
R124  56k  R_0603  [R0603]
R125  100k  R_0603  [R0603]

### Nets
+5VA: C53.2 C55.2 C91.2 C92.2 IC6.8(P:V+) IC7.8(P:V+) IC14.8(P:V+) IC15.8(P:V+) LED5.A LED7.A R122.1 R124.1 ; also sheet 2,3,6,7
AGND: C53.1 C55.1 C83.- C84.- C91.1 C92.1 IC6.4(P:V-) IC7.4(P:V-) IC14.3(A:IN+) IC14.4(P:V-) IC15.3(A:IN+) IC15.4(P:V-) LED4.C LED6.C R73.1 R74.1 R94.2 R95.2 R123.2 R125.2 ; also sheet 3,5,6,7,8
GAINL-1: C54.+ C59.1 IC6.7(B:OUT) J10._0
GAINL-2: C59.2 IC6.6(B:IN-) R12.1 R14.1 R79.2
GAINR-1: C56.+ C60.1 IC7.7(B:OUT) J10.0
GAINR-2: C60.2 IC7.6(B:IN-) R5.1 R9.1 R80.2
IN1L-J^: C57.- ; also sheet 6
IN1L^: C54.- D11.A IC15.2(A:IN-) R73.2 R120.2 ; also sheet 6
IN1R-J^: C58.- ; also sheet 6
IN1R^: C56.- D12.A IC14.2(A:IN-) R74.2 R121.2 ; also sheet 6
IN-VREF: P4.2 P4.3 P5.2 P5.3 R77.1 R78.1 R79.1 R80.1 ; also sheet 7
N$153: C57.+ IC6.3(A:IN+) R77.2
N$158: IC6.1(A:OUT) IC6.2(A:IN-) P4.6
N$159: C63.- IC6.5(B:IN+)
N$162: D8.A D11.C IC15.1(A:OUT) R120.1
N$164: LED7.C R60.2
N$165: C63.+ P4.1
N$166: D8.C R106.2
N$167: C83.+ IC15.6(B:IN-) R57.1 R94.1 R106.1
N$168: LED5.C R58.2
N$169: C58.+ IC7.3(A:IN+) R78.2
N$171: J10._2 R12.2
N$172: IC7.1(A:OUT) IC7.2(A:IN-) P5.6
N$173: LED4.A R57.2
N$175: J10._1 R14.2
N$176: J10.2 R9.2
N$177: J10.1 R5.2
N$178: IC15.7(B:OUT) R58.1
N$179: IC15.5(B:IN+) R122.2 R123.1
N$180: C64.- IC7.5(B:IN+)
N$182: C64.+ P5.1
N$184: D9.A D12.C IC14.1(A:OUT) R121.1
N$185: D9.C R107.2
N$186: C84.+ IC14.6(B:IN-) R59.1 R95.1 R107.1
N$188: LED6.A R59.2
N$190: IC14.7(B:OUT) R60.1
N$191: IC14.5(B:IN+) R124.2 R125.1
Unconnected: P4.4 P4.5 P5.4 P5.5